# Altium project CarrierMotherboard.PrjPcb (part 2 of 3)

## Sheet Battery.SchDoc
size A3; SheetNumber: 5; SheetTotal: 9
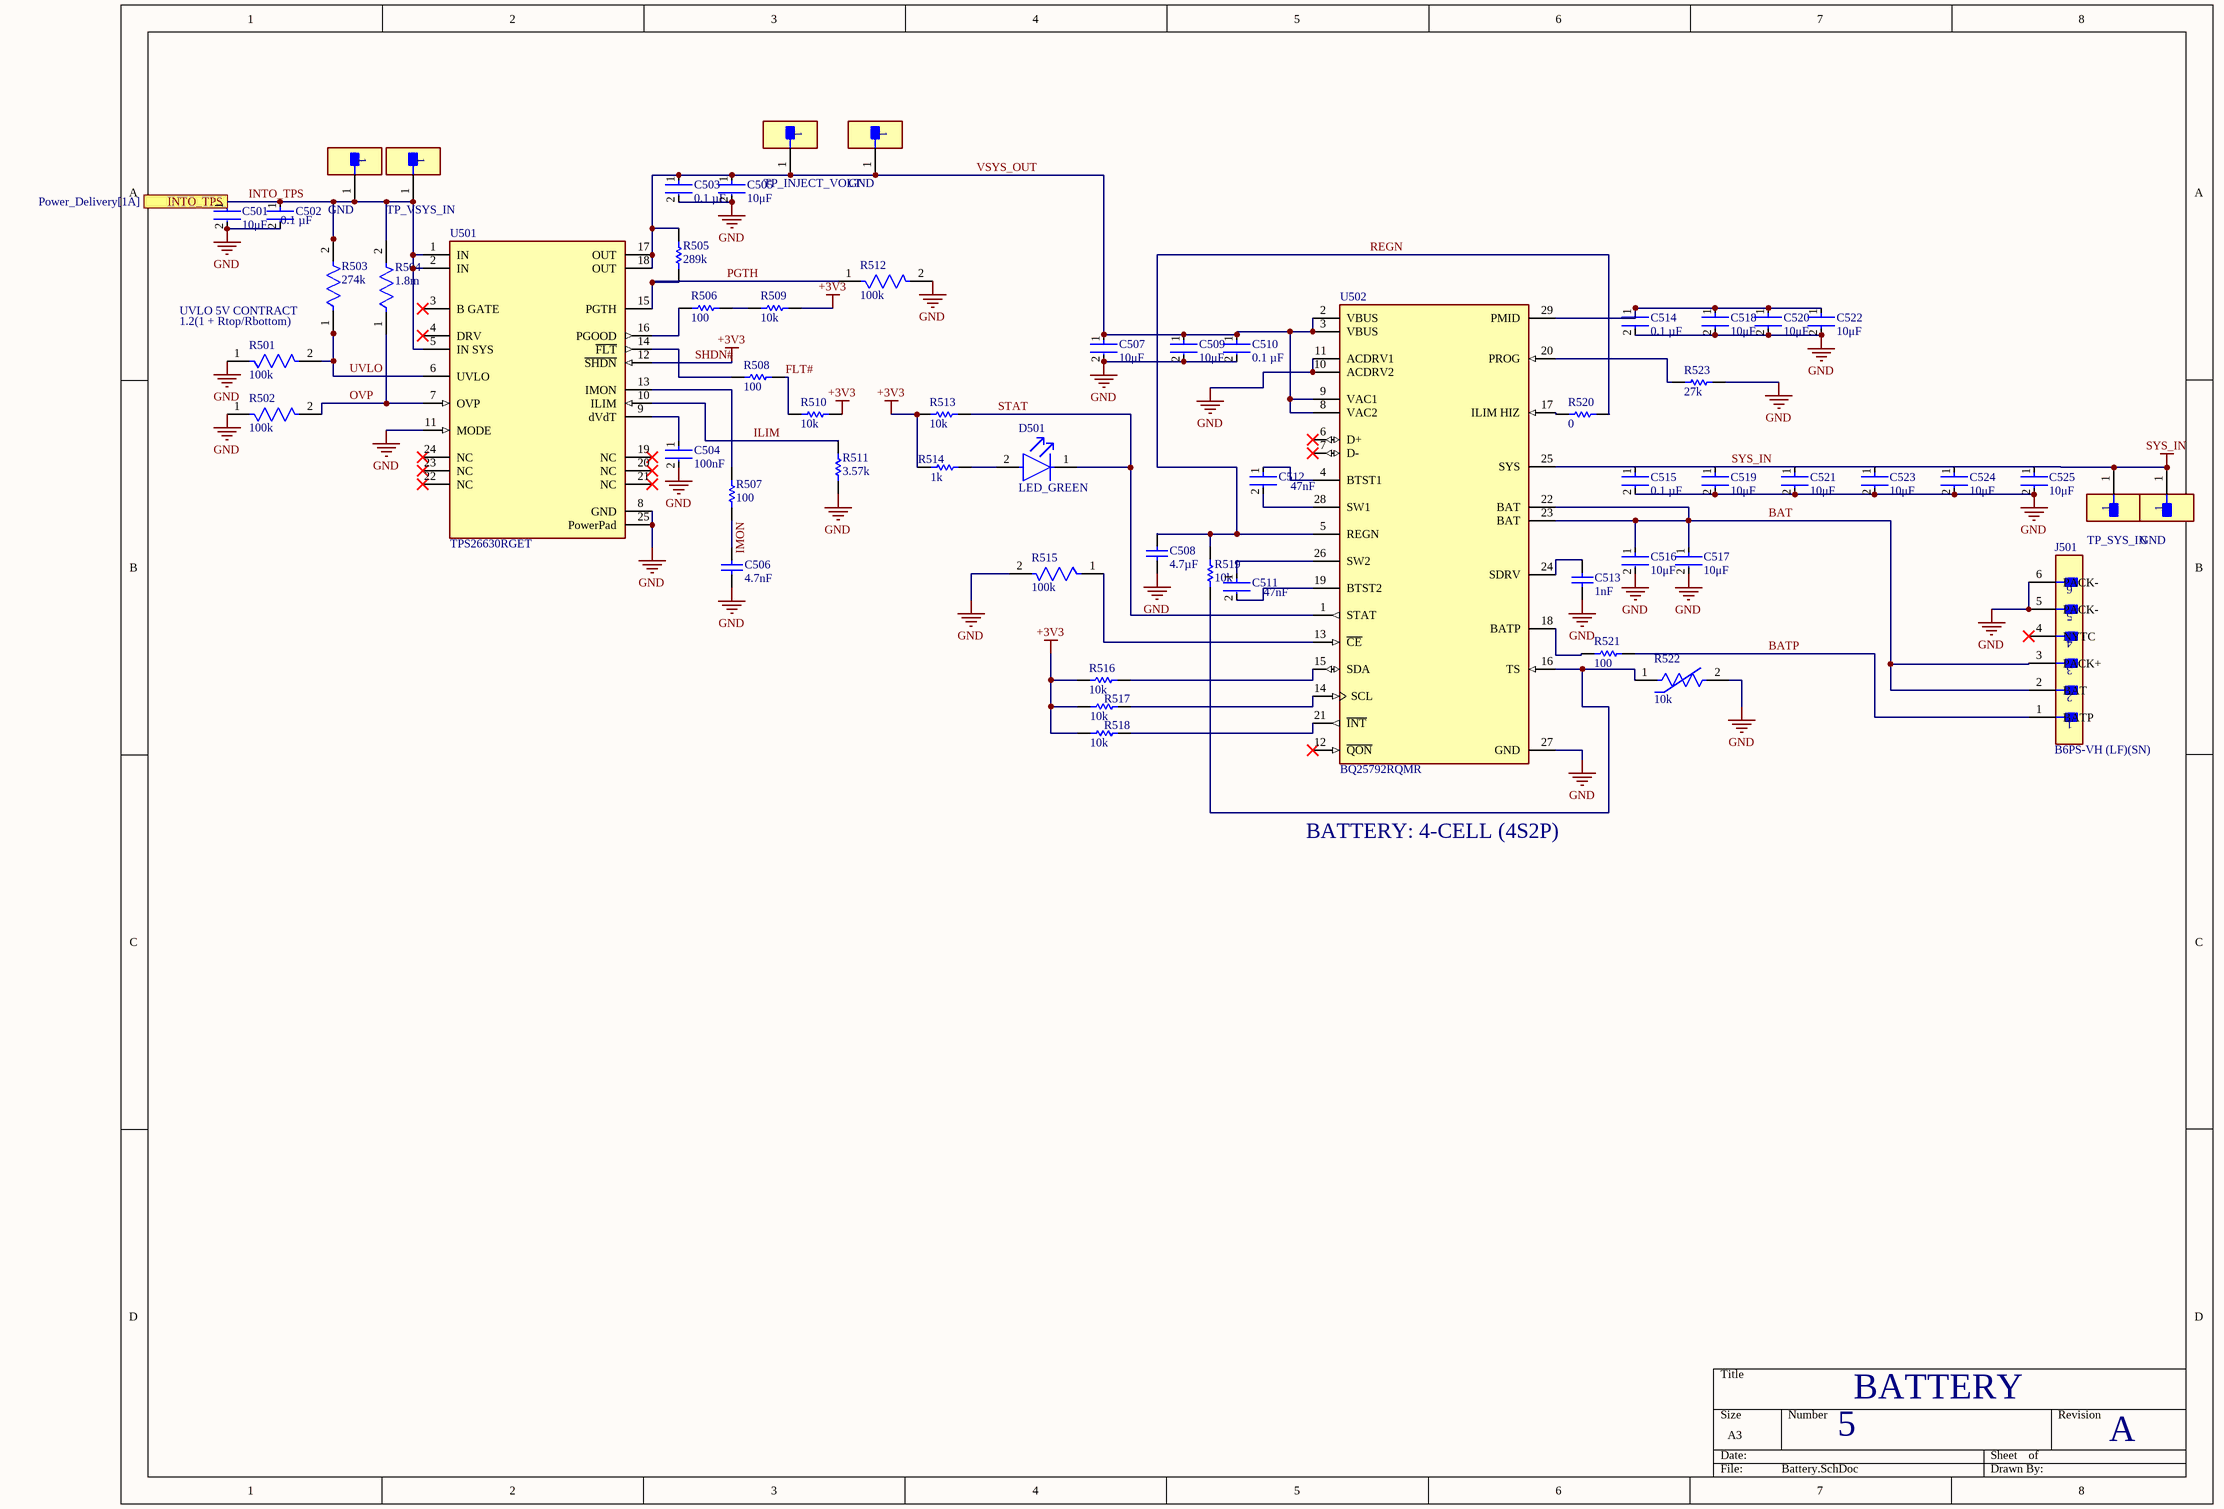
[diagram p5: Battery.SchDoc]

### Parts
C501  10μF  [FP-GRM31C-0_2-e0_3_0_8-MFG]
C502  0.1 µF  [FP-GRM155-0_05-IPC_B]
C503  0.1 µF  [FP-GRM155-0_05-IPC_B]
C504  100nF  [FP-GRM155-0_05-IPC_C]
C505  10μF  [FP-GRM31C-0_2-e0_3_0_8-MFG]
C506  4.7nF  [CAPC1005X55X25LL05T10]
C507  10μF  [FP-GRM31C-0_2-e0_3_0_8-MFG]
C508  4.7µF  [CAPC1608X90X35NL10T15]
C509  10μF  [FP-GRM31C-0_2-e0_3_0_8-MFG]
C510  0.1 µF  [FP-GRM155-0_05-IPC_B]
C511  47nF  [FP-GRM155-0_05-MFG]
C512  47nF  [FP-GRM155-0_05-MFG]
C513  1nF  [CAPC1005X55X25ML5T10]
C514  0.1 µF  [FP-GRM155-0_05-IPC_B]
C515  0.1 µF  [FP-GRM155-0_05-IPC_B]
C516  10μF  [FP-GRM31C-0_2-e0_3_0_8-MFG]
C517  10μF  [FP-GRM31C-0_2-e0_3_0_8-MFG]
C518  10μF  [FP-GRM31C-0_2-e0_3_0_8-MFG]
C519  10μF  [FP-GRM31C-0_2-e0_3_0_8-MFG]
C520  10μF  [FP-GRM31C-0_2-e0_3_0_8-MFG]
C521  10μF  [FP-GRM31C-0_2-e0_3_0_8-MFG]
C522  10μF  [FP-GRM31C-0_2-e0_3_0_8-MFG]
C523  10μF  [FP-GRM31C-0_2-e0_3_0_8-MFG]
C524  10μF  [FP-GRM31C-0_2-e0_3_0_8-MFG]
C525  10μF  [FP-GRM31C-0_2-e0_3_0_8-MFG]
D501  LED_GREEN  [FP-SML-D12-MFG]
J501  B6PS-VH (LF)(SN)  [FP-B6PS-VH_LF_SN-MFG]
R501  100k  [FP-RC0402-0_4-IPC_A]
R502  100k  [FP-RC0402-0_4-IPC_A]
R503  274k  [FP-AC0603-IPC_C]
R504  1.8m  [FP-CRCW0402-e3-MFG]
R505  289k  [RESC1005X40X25LL05T10]
R506  100  [RESC1005X40X25ML05T10]
R507  100  [RESC1005X40X25ML05T10]
R508  100  [RESC1005X40X25ML05T10]
R509  10k  [RESC1005X40X25LL05T10]
R510  10k  [RESC1005X40X25LL05T10]
R511  3.57k  [RESC1005X40X25ML05T10]
R512  100k  [FP-RC0402-0_4-IPC_A]
R513  10k  [RESC1005X40X25LL05T10]
R514  1k  [RESC3216X60X45ML15T20]
R515  100k  [FP-RC0402-0_4-IPC_A]
R516  10k  [RESC1005X40X25LL05T10]
R517  10k  [RESC1005X40X25LL05T10]
R518  10k  [RESC1005X40X25LL05T10]
R519  10k  [RESC1005X40X25LL05T10]
R520  0  [RESC1005X40X25NL05T10]
R521  100  [RESC1005X40X25ML05T10]
R522  10k  [FP-NCP15-NCU15-0_05-IPC_C]
R523  27k  [RESC1005X40X25LL05T10]
TP500  GND  [FP-S2751-46R-MFG]
TP501  TP_VSYS_IN  [FP-S2751-46R-MFG]
TP502  TP_INJECT_VOLT  [FP-S2751-46R-MFG]
TP503  GND  [FP-S2751-46R-MFG]
TP504  TP_SYS_IN  [FP-S2751-46R-MFG]
TP505  GND  [FP-S2751-46R-MFG]
U501  TPS26630RGET  [FP-RGE0024H-MFG]
U502  BQ25792RQMR  [FP-RQM0029A-MFG]

### Ports
INTO_TPS (see Power_Delivery[1A])

### Nets
+3V3: R509.2 R510.2 R513.1 R514.2 R516.1 R517.1 R518.1 U501.12(~{SHDN})  [also labelled SHDN#]  [project net 3V3_M2]
GND: C501.2 C502.2 C503.2 C504.2 C505.2 C506.1 C507.2 C508.1 C509.2 C510.2 C513.1 C514.2 C515.2 C516.2 C517.2 C518.2 C519.2 C520.2 C521.2 C522.2 C523.2 C524.2 C525.2 J501.5(PACK-) J501.6(PACK-) R501.1 R502.1 R511.1 R512.2 R515.2 R522.2 R523.2 U501.8(GND) U501.11(MODE) U501.25(PowerPad) U502.10(ACDRV2) U502.11(ACDRV1) U502.27(GND)  [project net 3V3_VDRV]
SYS_IN: TP504.1 TP505.1 U502.25(SYS)
BAT: C516.1 C517.1 J501.2(BAT) J501.3(PACK+) U502.22(BAT) U502.23(BAT)
BATP: J501.1(BATP) R521.2
FLT#: R508.2 R510.1
ILIM: R511.2 U501.10(ILIM)
IMON: C506.2 R507.1
INTO_TPS: C501.1 C502.1 R503.2 R504.2 TP500.1 TP501.1 U501.1(IN) U501.2(IN) U501.5(IN_SYS) ; port INTO_TPS
OVP: R502.2 R504.1 U501.7(OVP)
PGTH: R505.1 R512.1 U501.15(PGTH)
REGN: C508.2 R519.1 R520.2 U502.5(REGN)
STAT: D501.1(C) R513.2 U502.1(STAT)
UVLO: R501.2 R503.1 U501.6(UVLO)
VSYS_OUT: C503.1 C505.1 C507.1 C509.1 C510.1 R505.2 TP502.1 TP503.1 U501.17(OUT) U501.18(OUT) U502.2(VBUS) U502.3(VBUS) U502.8(VAC2) U502.9(VAC1)
NetC504_1: C504.1 U501.9(dVdT)
NetC511_1: C511.1 U502.26(SW2)
NetC511_2: C511.2 U502.19(BTST2)
NetC512_1: C512.1 U502.4(BTST1)
NetC512_2: C512.2 U502.28(SW1)
NetC513_2: C513.2 U502.24(SDRV)
NetC514_1: C514.1 C518.1 C520.1 C522.1 U502.29(PMID)
NetD501_2: D501.2(A) R514.1
NetR506_1: R506.1 U501.16(PGOOD)
NetR506_2: R506.2 R509.1
NetR507_2: R507.2 U501.13(IMON)
NetR508_1: R508.1 U501.14(~{FLT})
NetR515_1: R515.1 U502.13(~{CE})
NetR516_2: R516.2 U502.15(SDA)
NetR517_2: R517.2 U502.14(SCL)
NetR518_2: R518.2 U502.21(~{INT})
NetR519_2: R519.2 R522.1 U502.16(TS)
NetR520_1: R520.1 U502.17(ILIM_HIZ)
NetR521_1: R521.1 U502.18(BATP)
NetR523_1: R523.1 U502.20(PROG)

Not connected (* = marked no-connect by the designer): C515 1; C519 1; C521 1; C523 1; C524 1; C525 1; J501 4(NYTC)*; U501 3(B_GATE)* 4(DRV)* 19(NC)* 20(NC)* 21(NC)* 22(NC)* 23(NC)* 24(NC)*; U502 6(D+)* 7(D-)* 12(~{QON})*

### Notes on the sheet
- UVLO 5V CONTRACT
- 1.2(1 + Rtop/Rbottom)
- BATTERY: 4-CELL (4S2P)
- 5
- BATTERY
- A

### Library data of the parts
C501 C505 C507 C509 C516-C525 = CMP-06035-005515-1: Chip Multilayer Ceramic Capacitors for General Purpose, 1206, 10uF, X7R, 15%, 10%, 25V; Dielectric: X7R; Max Operating Temperature: 125°C; Capacitance: 10uF; Voltage Rating (DC): 25V; Case/Package: 1206; Thickness: 0.071inch; Tolerance: 10%; Voltage Rating: 25V; Mount: Surface Mount; Width: 0.063inch; Length: 0.126inch; Min Operating Temperature: -55°C; Packaging: Tape and Reel; Lead Free: Lead Free; Voltage: 25V
C502 C503 C510 C514 C515 = CMP-06035-003750-1: Chip Multilayer Ceramic Capacitors for General Purpose, 0402, 0.10uF, X7R, 15%, 10%, 50V; Capacitance: 100nF; Weight: 0.000212oz; Package Quantity: 50000; Resistor Type: Ceramic; Mount: Surface Mount; Width: 0.5mm; Case Code (Imperial): 0402; Termination: SMD/SMT; Case/Package: 0402; Voltage Rating: 50V; Height: 0.5mm; Length: 0.039inch; Dielectric: X7R; Case Code (Metric): 1005; Min Operating Temperature: -55°C; Thickness: 0.022inch; Tolerance: 10%; Lead Free: Lead Free; Packaging: Tape and Reel; Max Operating Temperature: 125°C; Voltage Rating (DC): 50V
C504 = CMP-06035-003995-1: Chip Multilayer Ceramic Capacitors for General Purpose, 0402, 0.10uF, X7R, 15%, 10%, 25V; Resistor Type: Ceramic; Capacitance: 100nF; Tolerance: 10%; Case Code (Metric): 1005; Termination: SMD/SMT; Mount: Surface Mount; Voltage Rating: 25V; Voltage Rating (DC): 25V; Case Code (Imperial): 0402; Max Operating Temperature: 125°C; Weight: 0.000212oz; Case/Package: 0402; Length: 0.039inch; Width: 0.5mm; Thickness: 0.022inch; Height: 0.5mm; Packaging: Tape and Reel; Package Quantity: 50000; Min Operating Temperature: -55°C; Dielectric: X7R
C506 = CMP-2008-04609-1: Manufacturer: Murata; Part Number: GRM155R71C472KA01D
C508 = CMP-2006-02810-1: Manufacturer: Murata; Part Number: GRM188R61A475KE15D
C511 C512 = CMP-06035-009452-1: Chip Multilayer Ceramic Capacitors for General Purpose, 0402, 47000pF, X7R, 15%, 10%, 50V; Tolerance: 10%; Capacitance: 47nF; Max Operating Temperature: 125°C; Termination: SMD/SMT; Width: 0.02inch; Package Quantity: 10000; Resistor Type: Ceramic; Packaging: Tape and Reel; Height: 0.5mm; Voltage Rating (DC): 50V; Length: 0.039inch; Dielectric: X7R; Case Code (Imperial): 0402; Voltage Rating: 50V; Mount: Surface Mount; Min Operating Temperature: -55°C; Case Code (Metric): 1005; Weight: 0.000212oz; Case/Package: 0402; Thickness: 0.022inch
C513 = CMP-1662-00017-1: Chip Capacitor, 1 nF, +/- 10%, 50 V, -55 to 125 degC, 0402 (1005 Metric), RoHS, Tape and Reel; Case\/Package: 0402; Type (Capacitors): X7R; Voltage Rating (DC): 50 V; Width: 0.5 mm; Pins: 2; REACH SVHC: No SVHC; Length: 1 mm; Height: 0.5 mm; PackageDescription: 2-Pin Surface Mount Device, Body 1 x 0.5 mm; DatasheetVersion: 07/2016; Mount: Surface Mount; ComponentLink2Description: Datasheet; Tolerance: 10%; ComponentLink2URL: http://psearch.en.murata.com/capacitor/product/GRM155R71H102KA01%23.pdf; ComponentLink1URL: http://www.murata.com/; Case Code (Metric): 1005; Package Quantity: 10000; Min Operating Temperature: -55 degC; Max Operating Temperature: 125 degC; Capacitance: 1 nF; Voltage Rating: 50 V; ComponentLink1Description: Manufacturer URL; Packaging: Tape and Reel; Radiation Hardening: No; RoHSCompliant: true; PackageReference: 0402; Mounting Technology: Surface Mount; Case Code (Imperial): 0402
D501 = CMP-08952-000005-1: LED YLW/GREEN DIFFUSED 1608 SMD; Manufacturer Part Number: SML-D12M1WT86; Manufacturer: Rohm; Led Orientation: Top View; Forward Voltage: 2.2V; Power Dissipation: 54mW; Wavelength: 572nm; Colour: Green; Reverse Voltage: 5V; Forward Current: 20mA; Luminous Intensity: 30mcd; RoHS: TRUE; Package: SML-D12; Temperature Range Low: -40°C; Device Class L3: unset; Temperature Range High: +85°C; Device Class L2: LEDs; Category: Diode; Device Class L1: Optoelectronics; Digikey Description: LED YLW/GREEN DIFFUSED 1608 SMD; Temperature: -40°C to +85°C; ComponentLink2Description: Datasheet; Automotive: No; Height: 0.65mm; Lead Free: Yes; Octopart: https://octopart.com/sml-d12m1wt86-rohm-70837112; ComponentLink2URL: https://www.rohm.com/datasheet/SML-D12M1W
J501 = CMP-17439-000282-2: CONN HEADER R/A 6POS 3.96MM; Gender: Male; Contact Resistance: 20mR; Max Current Rating: 10A; Voltage Rating: 250V; Number of Contacts: 6; Packaging: Bulk; Current Rating: 10A; Contact Mating Length: 0.303inch; Fastening Type: Ramp; Contact Material: Brass; Number of Rows: 1; Termination: Solder; Number of Positions: 6; Depth: 14.9mm; Orientation: Right Angle; Contact Finish - Mating: TIN; Contact Plating: Copper; Mount: Through Hole; Insulation Material: Nylon; Contact Type: Male Pin; Insulation Color: Natural; Max Voltage Rating (AC): 250V; Housing Color: White; Length: 23.7mm; Min Operating Temperature: -25°C; Series: VH; Connector Type: Header; Pitch: 3.96mm; Flammability Rating: UL94 V-0; Max Operating Temperature: 85°C; Color: Natural; Lead Free: Lead Free; Housing Material: Polyamide; Contact Shape: Square
R501 R502 R512 R515 = CMP-2002-07913-2: RES 100K OHM 5% 1/16W 0402; Temperature Coefficient: 100ppm/°C; Max Power Dissipation: 63mW; Resistance: 100kR; Voltage Rating: 50V; Tolerance: 5%; Packaging: Tape and Reel; Termination: SMD/SMT; Case Code (Metric): 1005; Length: 1mm; Power Rating: 63mW; Min Operating Temperature: -55°C; Case/Package: 0402; Construction: Rectangular; Series: RC; Resistance Tolerance: 5%; Height: 0.016inch; Case Code (Imperial): 0402; RoHS Compliant: Yes; Size Code: 0402; Number of Terminations: 2; Features: Moisture Resistant; Width: 0.02inch; Max Operating Temperature: 155°C; Military Standard: Not; Lead Free: Lead Free; Depth: 0.5mm; Package Quantity: 1; Resistor Type: Thick Film
R503 = CMP-03412-027770-2: RES 274KΩ 1.00% 0.1W 0603; Resistance: 274kR; Max Power Dissipation: 100mW; Tolerance: 1%; Temperature Coefficient: 100ppm/°C; Voltage Rating: 50V; Features: Moisture Resistant; Min Operating Temperature: -55°C; Width: 0.8mm; RoHS Compliant: Yes; Resistor Type: Thick Film; Termination: SMD/SMT; Number of Terminations: 2; Power Rating: 100mW; Case Code (Metric): 1608; Max Operating Temperature: 155°C; Series: AC; Length: 0.063inch; Case/Package: 0603; Weight: 7.1E-05oz; Case Code (Imperial): 0603; Height: 0.022inch; Packaging: Tape and Reel
R504 = CMP-2002-08335-4: RES Thick Film, 1.78MΩ, 1%, 0.063W, 100ppm/°C, 0402; Max Power Dissipation: 63mW; Resistance: 1.78MR; Voltage Rating: 50V; Package Quantity: 10000; Depth: 0.5mm; Length: 1mm; Weight: 2.3E-05oz; Width: 0.5mm; Case Code (Imperial): 0402; Radiation Hardening: No; Number of Terminations: 2; Temperature Coefficient: 100ppm/°C; Lead Free: Lead Free; Contact Plating: Tin; Voltage Rating (DC): 50V; Height: 0.016inch; Features: Automotive AEC-Q200; Case Code (Metric): 1005; Max Operating Temperature: 155°C; Case/Package: 0402; Number of Pins: 2; Power Rating: 63mW; Tolerance: 1%; Packaging: Tape and Reel; Military Standard: Not; Composition: Thick Film; Min Operating Temperature: -55°C
R505 = CMP-1011-00786-2: Part Number: RC0402FR-07287KL; Manufacturer: Yageo
R506-R508 R521 = CMP-2002-07344-1: Part Number: RC0402FR-07100RL; Manufacturer: Yageo / Phycomp
R509 R510 R513 R516-R519 = CMP-2002-07353-1: Part Number: RC0402FR-0710KL; Manufacturer: Yageo / Phycomp
R511 = CMP-2002-07655-1: Part Number: RC0402FR-073K57L; Manufacturer: Yageo
R514 = CMP-2100-03616-1: Chip Resistor, 1 KOhm, +/- 1%, 0.25 W, -55 to 155 degC, 1206 (3216 Metric), RoHS, Tape and Reel; Manufacturer: Vishay Semiconductor; Power Rating: 250mW; Voltage Rating (DC): 200V; Resistance: 1KOhm; Temperature Coefficient: 100ppm/degreesC; Case Code (Imperial): 1206; Length: 3.2mm; Case/Package: 1206; Contact Plating: Tin; Package Quantity: 10; Datasheet URL: http://www.farnell.com/datasheets/1720486.pdf; Mount: SurfaceMount; Package Description: 2-Pin Surface Mount Device, Body 3.15 x 1.6 mm; Package Reference: 1206.0; Max Operating Temperature: 155degC; Lead Free: LeadFree; Weight: 0.000353oz; Military Standard: Not; Max Power Dissipation: 250mW; Case Code (Metric): 3216; Number of Terminations: 2; Tolerance: 1%; Width: 0.063inch; Termination: SMD/SMT; Number of Pins: 2; Min Operating Temperature: -55degC; Height: 0.55mm; Depth: 1.6mm; RoHSCompliant: true; Composition: ThickFilm; Packaging: TapeandReel; Manufacturer URL: http://www.vishay.com/; Voltage Rating: 200V; Radiation Hardening: No; REACH SVHC: Unknown; Datasheet Version: 41061.0
R520 = CMP-1011-00001-2: Manufacturer: Yageo / Phycomp; Part Number: RC0402JR-070RL
R522 = CMP-06022-000003-3: NTC Thermistor for Temperature Sensor, 0402, 10kΩ, 1%, 0.1mA, 5V; Max Power Dissipation: 100mW; Resistance: 10kR; Current Rating: 310uA; Length: 1mm; Min Operating Temperature: -40°C; Max Operating Temperature: 125°C; Resistance Tolerance: 1%; Lead Free: Lead Free; Radiation Hardening: No; Case Code (Imperial): 0402; Depth: 0.5mm; Tolerance: 1%; Packaging: Tape and Reel; Package Quantity: 10000; Series: NCP; Number of Pins: 2; Power Rating: 100mW; Case/Package: 0402; Case Code (Metric): 1005; Height: 0.5mm; Termination: SMD/SMT; RoHS Compliant: Yes; REACH SVHC: No SVHC; Mount: Surface Mount
R523 = CMP-2002-07025-1: Manufacturer: Yageo / Phycomp; Part Number: RC0402FR-0727KL
TP500-TP505 = CMP-15817-000010-1: PC TEST POINT NATURAL; Plating: Tin; Body Material: Brass; Color: Natural; Material: Copper Alloy; Mount: Surface Mount; Packaging: Cut Tape
U501 = CMP-04910-000050-1: POWER MANAGEMENT; RoHS Compliant: Yes
U502 = CMP-04911-000031-1: I2C CONTROLLED, 5-A, 1-4 CELL BU; RoHS Compliant: Yes

## Sheet DCDC.SchDoc
size A3; SheetNumber: 6; SheetTotal: 9
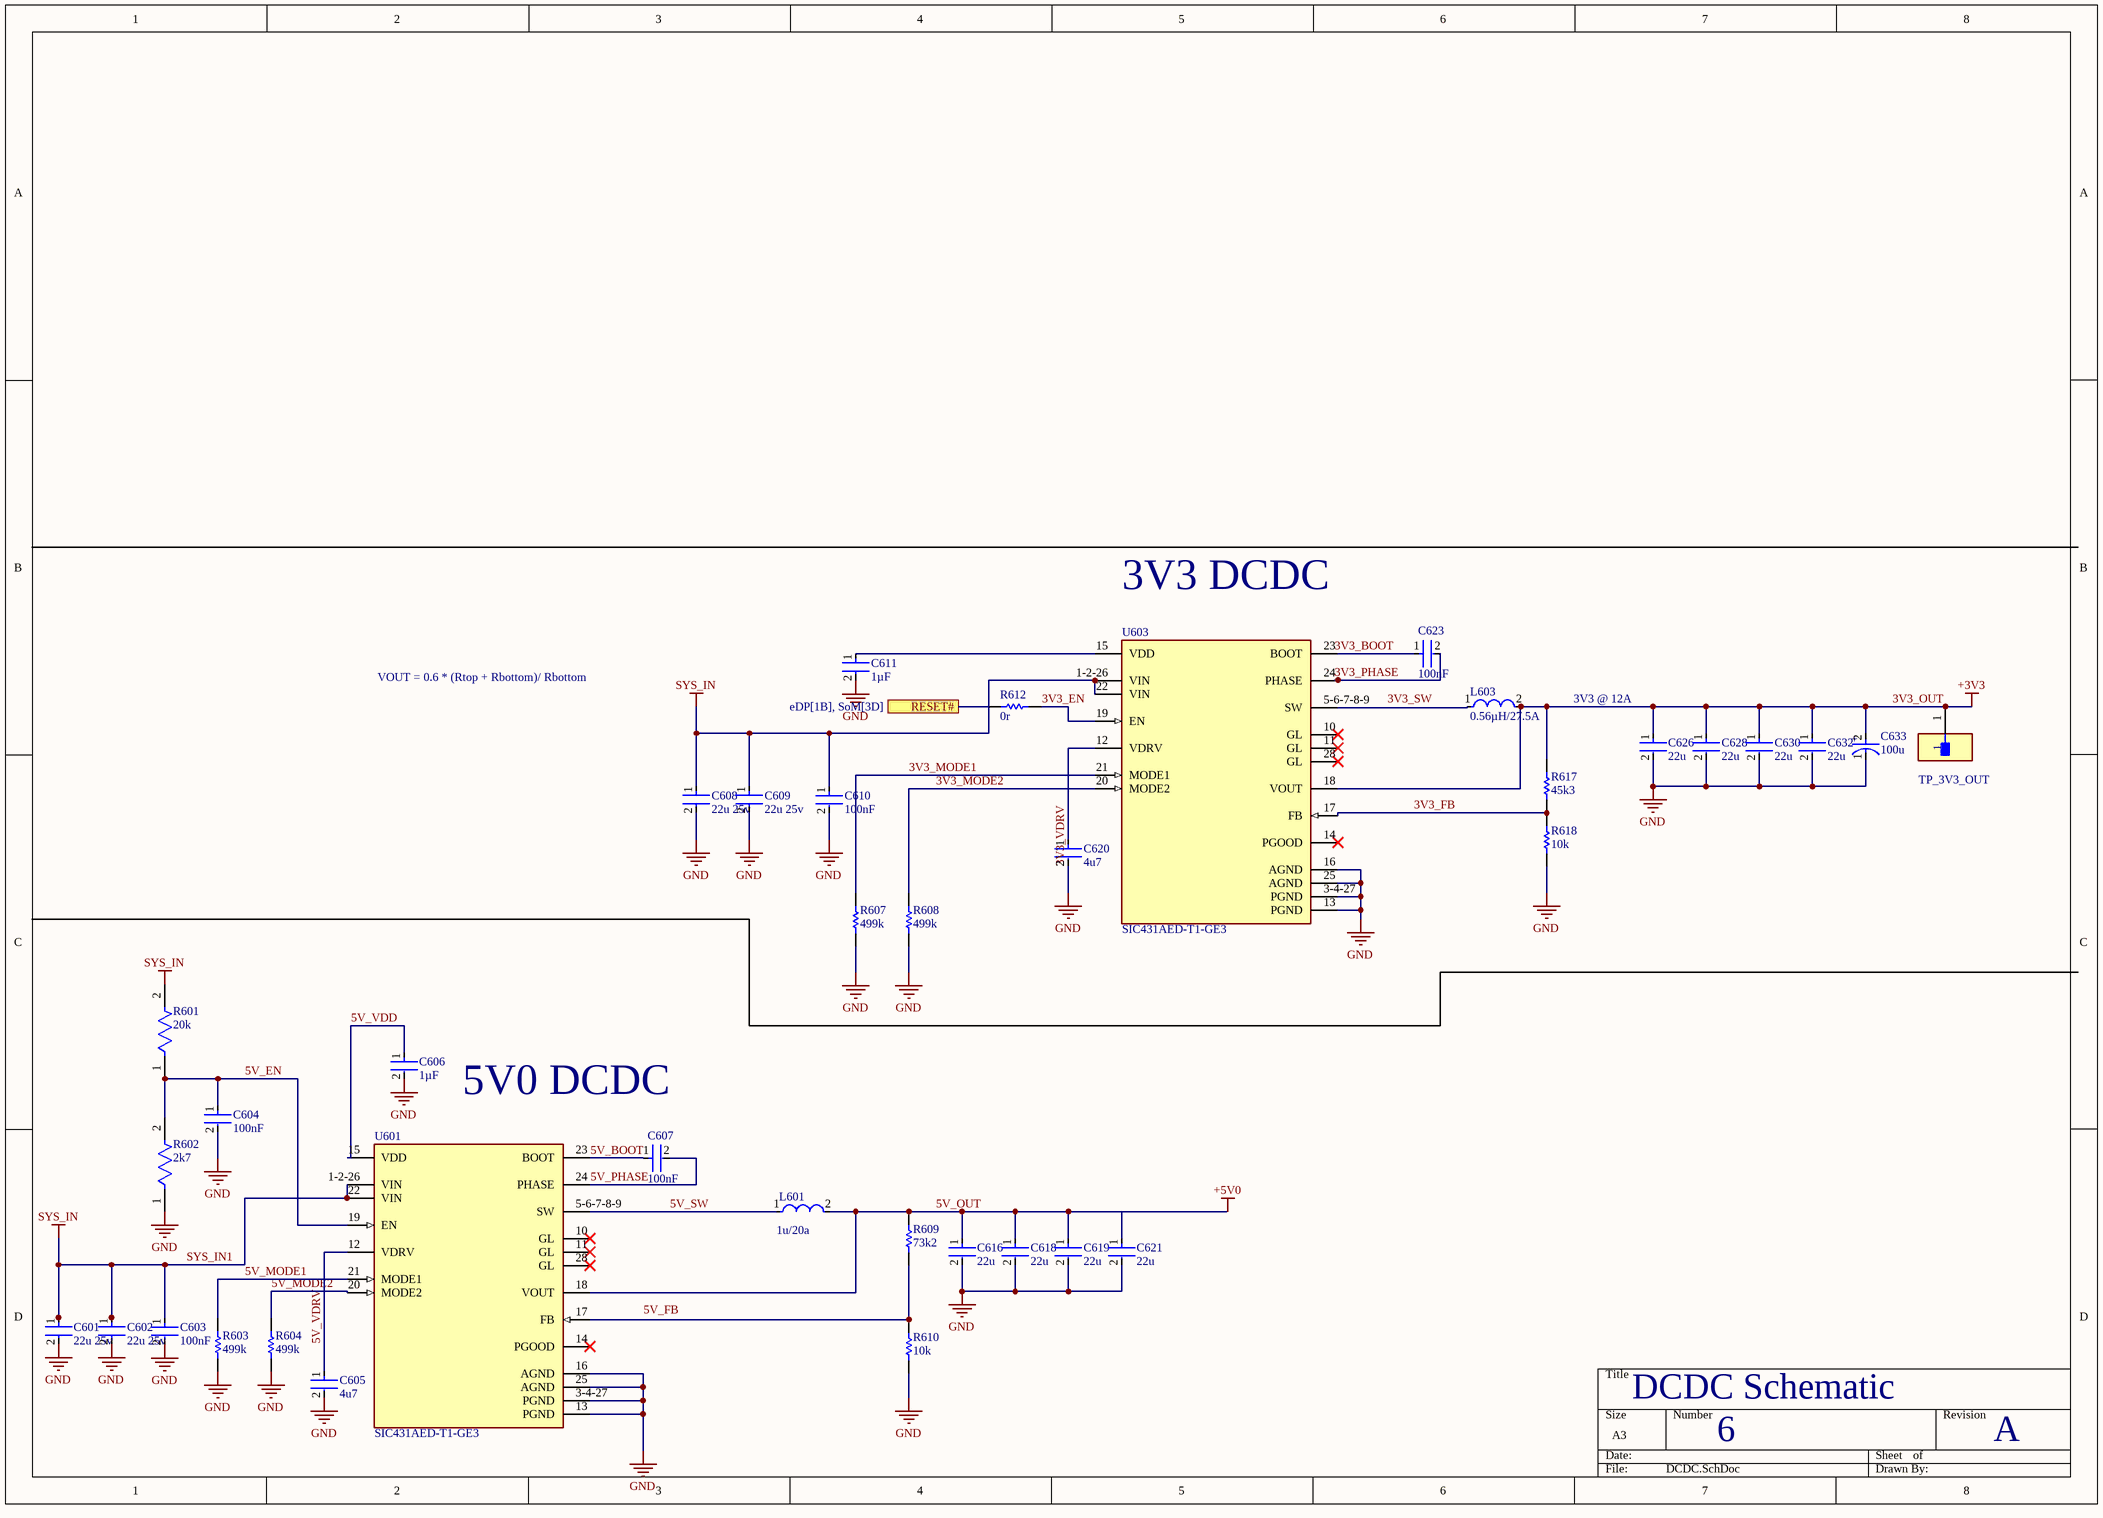
[diagram p6: DCDC.SchDoc]

### Parts
C601  22u 25v  [FP-GRM21B-0_2-e0_2_0_7-IPC_B]
C602  22u 25v  [FP-GRM21B-0_2-e0_2_0_7-IPC_B]
C603  100nF  [FP-GRM155-0_05-IPC_B]
C604  100nF  [FP-GRM155-0_05-IPC_B]
C605  4u7  [FP-GRM155-0_2-MFG]
C606  1µF  [FP-GRM15-0_1-MFG]
C607  100nF  [FP-GRM155-0_05-IPC_B]
C608  22u 25v  [FP-GRM21B-0_2-e0_2_0_7-IPC_B]
C609  22u 25v  [FP-GRM21B-0_2-e0_2_0_7-IPC_B]
C610  100nF  [FP-GRM155-0_05-IPC_B]
C611  1µF  [FP-GRM15-0_1-MFG]
C616  22u  [FP-CL10-IPC_B]
C618  22u  [FP-CL10-IPC_B]
C619  22u  [FP-CL10-IPC_B]
C620  4u7  [FP-GRM155-0_2-MFG]
C621  22u  [FP-CL10-IPC_B]
C623  100nF  [FP-GRM155-0_05-IPC_B]
C626  22u  [FP-CL10-IPC_B]
C628  22u  [FP-CL10-IPC_B]
C630  22u  [FP-CL10-IPC_B]
C632  22u  [FP-CL10-IPC_B]
C633  100u  [FP-OS-CON-SMT-B6-MFG]
L601  1u/20a  [FP-SRP6050CA-MFG]
L603  0.56µH/27.5A  [FP-IHLP-4040DZ-FP_3_175x4-MFG]
R601  20k  [FP-CR0402-IPC_A]
R602  2k7  [FP-CR0402-IPC_B]
R603  499k  [RESC1005X40X25NL10T10]
R604  499k  [RESC1005X40X25NL10T10]
R607  499k  [RESC1005X40X25NL10T10]
R608  499k  [RESC1005X40X25NL10T10]
R609  73k2  [RESC1005X40X25LL10T10]
R610  10k  [RESC1005X40X25LL05T10]
R612  0r  [RESC1005X40X25LL05T05]
R617  45k3  [RESC1005X40X25ML05T10]
R618  10k  [RESC1005X40X25LL05T10]
TP603  TP_3V3_OUT  [FP-S2751-46R-MFG]
U601  SIC431AED-T1-GE3  [FP-T22-0442-MFG]
U603  SIC431AED-T1-GE3  [FP-T22-0442-MFG]

### Ports
RESET# (see eDP[1B], SoM[3D])

### Nets
3V3_VDRV: C601.2 C602.2 C603.2 C604.2 C605.2 C606.2 C608.2 C609.2 C610.2 C611.2 C616.2 C618.2 C619.2 C620.2 C621.2 C626.2 C628.2 C630.2 C632.2 C633.1(C) R602.1 R603.1 R604.1 R607.1 R608.1 R610.1 R618.1 U601.3-4-27(PGND) U601.13(PGND) U601.16(AGND) U601.25(AGND) U603.3-4-27(PGND) U603.13(PGND) U603.16(AGND) U603.25(AGND)  [also labelled GND]
+3V3: C626.1 C628.1 C630.1 C632.1 C633.2(A) L603.2 R617.2 TP603.1 U603.18(VOUT)  [also labelled 3V3_OUT]  [project net 3V3_M2]
SYS_IN: C601.1 C602.1 C603.1 C608.1 C609.1 C610.1 R601.2 U601.1-2-26(VIN) U601.22(VIN) U603.1-2-26(VIN) U603.22(VIN)  [also labelled SYS_IN1]
3V3_EN: R612.2 U603.19(EN)
3V3_FB: R617.1 R618.2 U603.17(FB)
3V3_MODE1: R607.2 U603.21(MODE1)
3V3_MODE2: R608.2 U603.20(MODE2)
3V3_PHASE: C623.2 U603.24(PHASE)
5V_EN: C604.1 R601.1 R602.2 U601.19(EN)
5V_MODE1: R603.2 U601.21(MODE1)
5V_MODE2: R604.2 U601.20(MODE2)
5V_OUT: C616.1 C618.1 C619.1 C621.1 L601.2 R609.2 U601.18(VOUT)
5V_PHASE: C607.2 U601.24(PHASE)
5V_SW: L601.1 U601.5-6-7-8-9(SW)
5V_VDD: C606.1 U601.15(VDD)
5V_VDRV: C605.1 U601.12(VDRV)
SYS_RESET#: R612.1 ; port RESET#
NetC607_1: C607.1 U601.23(BOOT)
NetC611_1: C611.1 U603.15(VDD)
NetC620_1: C620.1 U603.12(VDRV)
NetC623_1: C623.1 U603.23(BOOT)
NetL603_1: L603.1 U603.5-6-7-8-9(SW)
NetR609_1: R609.1 R610.2 U601.17(FB)

Not connected (* = marked no-connect by the designer): U601 10(GL)* 11(GL)* 14(PGOOD)* 28(GL)*; U603 10(GL)* 11(GL)* 14(PGOOD)* 28(GL)*

### Notes on the sheet
- (near U603) 3V3 DCDC
- VOUT = 0.6 * (Rtop + Rbottom)/ Rbottom
- 3V3 @ 12A
- 5V0 DCDC
- DCDC Schematic
- 6
- A
- Labels drawn without touching a wire or pin: 3V3_BOOT, 3V3_SW, 5V_BOOT, 5V_FB, +5V0
- (in symbol CMP-05428-000099-1) +

### Library data of the parts
C601 C602 C608 C609 = CMP-2007-03222-3: Chip Multilayer Ceramic Capacitors for General Purpose, 0805, 22uF, X5R, 15%, 20%, 25V; Case/Package: 0805; Depth: 1.25mm; Resistor Type: Ceramic; Voltage Rating: 25V; Lead Free: Lead Free; Voltage Rating (DC): 25V; Case Code (Metric): 2012; Thickness: 0.057inch; REACH SVHC: No SVHC; Material: Ceramic; Tolerance: 20%; Length: 2mm; Capacitance: 22uF; Case Code (Imperial): 0805; Max Operating Temperature: 85°C; Termination: SMD/SMT; Weight: 0.000335oz; Dielectric: X5R; Packaging: Tape and Reel; Voltage: 25V; Package Quantity: 3000; Height: 1.25mm; Mount: Surface Mount; Width: 1.25mm; Min Operating Temperature: -55°C
C603 C604 C607 C610 C623 = CMP-2008-04639-2: Chip Multilayer Ceramic Capacitors for General Purpose, 0402, 0.10uF, X7R, 15%, 10%, 50V; Dissipation Factor: 0.025%; Weight: 0.000212oz; Thickness: 0.022inch; Voltage Rating (DC): 50V; Dielectric Material: Ceramic; Termination: SMD/SMT; Case/Package: 0402; Case Code (Imperial): 0402; Mount: Surface Mount; REACH SVHC: No SVHC; Resistor Type: Ceramic; Dielectric: X7R; Max Operating Temperature: 125°C; Voltage: 50V; Lead Free: Lead Free; Package Quantity: 10000; Packaging: Tape and Reel; Capacitance: 100nF; Length: 1mm; Material: Ceramic; Height: 0.5mm; Depth: 0.5mm; Width: 0.5mm; Min Operating Temperature: -55°C; Tolerance: 10%; Case Code (Metric): 1005; Voltage Rating: 50V
C605 C620 = CMP-06035-063317-1: Chip Multilayer Ceramic Capacitors for General Purpose 0402 Package 0.7mm 4.7uF @ 20% 25Vdc X5S @ 22%
C606 C611 = CMP-2008-04556-2: CAP CER 1UF 10V X5R 0402; Manufacturer Part Number: GRM155R61A105KE15D; Manufacturer: Murata; Material: Ceramic; Tolerance: 10%; Temperature Coefficient: 15%; Octopart: https://octopart.com/grm155r61a105ke15d-murata-197442; Lead Free: Yes; ComponentLink2Description: Datasheet; Temperature: -55°C to +85°C; Temperature Range High: +85°C; Height: 0.55mm; Capacitance: 1uF; Ipc Land Pattern Name: CAPC10050X50; ComponentLink2URL: https://search.murata.co.jp/Ceramy/image/img/A01X/G101/ENG/GRM155R61A105KE15-01A.pdf; Temperature Range Low: -55°C; Device Class L2: Capacitors; Voltage Rating: 10V; RoHS: TRUE; Device Class L1: Passive Components; Device Class L3: Ceramic Capacitors; Temperature Characteristic: X5R; Mouser Description: 0402 1 uF 10 V ±10% Tolerance X5R Surface Mount Multilayer Ceramic Capacitor; Automotive: No; Package: GRM15-0.1; Digikey Description: CAP CER 1UF 10V X5R 0402; Value: 1uF; Category: Cap
C616 C618 C619 C621 C626 C628 C630 C632 = CMP-13271-002755-1: Cap Ceramic 22uF 16V X5R ±20% Pad SMD 0603 +85°C T/R; Mount: Surface Mount; Packaging: Tape and Reel; Case Code (Imperial): 0603; Max Operating Temperature: 85°C; Capacitance: 22uF; Case/Package: 0603; Voltage Rating: 16V; Tolerance: 20%; Case Code (Metric): 1608; Min Operating Temperature: -55°C
C633 = CMP-05428-000099-1: Conductive Polymer Aluminum Solid Capacitors (OS-CON) 100uF ±20% 6.3V; Ripple Current (AC): 1.97A; Dissipation Factor: 12%; Leakage Current: 300uA; ESR (Equivalent Series Resistance): 30mR; Life (Hours): 2000Hour; Polarity: Polar; Package Quantity: 1500; RoHS Compliant: Yes; Number of Pins: 6; Termination: SMD/SMT; Tolerance: 20%; Mount: Surface Mount; Case/Package: Radial; Ripple Current: 1.97A; Min Operating Temperature: -55°C; REACH SVHC: No SVHC; Height - Seated (Max): 0.236inch; Height: 5.9mm; Lead Free: Lead Free; Voltage: 6.3V; Capacitance: 100uF; Diameter: 5mm; Voltage Rating (DC): 6.3V; Construction: Cylindrical; Length: 5.9mm; Max Operating Temperature: 105°C; Packaging: Tape and Reel; Voltage Rating: 6.3V; Series: OS-CON™, SVPC
L601 = CMP-07248-000017-1: FIXED IND 1UH 20A 4.52 MOHM SMD; Manufacturer: Bourns; Manufacturer Part Number: SRP6050CA-1R0M; Shielding: true; Saturation Current: 23A; Core Material: Metal alloy powder; Series Resistance: 4.52mΩ; Tolerance: 20%; Self Resonant Frequency: 50MHz; Automotive Grade: Grade 0; Test Frequency: 100kHz; Octopart: https://octopart.com/srp6050ca-1r0m-bourns-92222725; Device Class L1: Passive Components; RoHS: TRUE; Device Class L2: Inductors; Temperature Range High: +155°C; Value: 1uH; Inductance: 1uH; Automotive: Yes; Height: 5mm; Package: SRP6050CA; Category: Ind; ComponentLink2Description: Datasheet; Device Class L3: Fixed Inductors; Mouser Description: Inductor Power Shielded Wirewound 1uH 20% 100KHz Metal Alloy Powder 20A 4.52mOhm DCR T/R; ComponentLink2URL: https://www.bourns.com/docs/Product-Datasheets/SRP6050CA.pdf; Lead Free: Yes; Temperature Range Low: -55°C; Rms Current: 20A; Temperature: -55°C to +155°C; Digikey Description: FIXED IND 1UH 20A 4.52 MOHM SMD; Composition: Wirewound
L603 = CMP-02424-000366-1: Commercial Inductors, High Saturation Series 0.56uH 27.5A 1.8mΩ 20%; Shielding: Shielded; Max DC Current: 49A; Inductance: 560nH; Core Material: Metal; DC Resistance (DCR): 1.8mR; Test Frequency: 100kHz; Self Resonant Frequency: 5MHz; Termination: SMD/SMT; RMS Current (Irms): 27.5A; Height: 4mm; Lead Free: Lead Free; Saturation Current: 49A; Tolerance: 20%; Contact Plating: Tin; Max Operating Temperature: 125°C; Case Code (Imperial): 4040; Radiation Hardening: No; Width: 10.3mm; Depth: 10.3mm; Length: 10.92mm; Min Operating Temperature: -55°C; Current Rating: 27.5A; Package Quantity: 500; Number of Pins: 2; Packaging: Tape and Reel; Military Standard: Not; Inductance Tolerance: 20%; Weight: 0.070548oz; Mount: Surface Mount; Case/Package: 4040
R601 = CMP-1011-00655-3: Thick Film Chip Resistors 0402 20kΩ 0.0625W 1% 100ppm/°C; Power Rating: 62.5mW; Voltage Rating: 50V; Resistance: 20kR; Tolerance: 1%; Case Code (Metric): 1005; Termination: SMD/SMT; Composition: Thick Film; Packaging: Tape and Reel; Radiation Hardening: No; Package Quantity: 10000; Mount: Surface Mount; Depth: 0.5mm; Max Operating Temperature: 125°C; Length: 1mm; Width: 0.5mm; Temperature Coefficient: 100ppm/°C; Min Operating Temperature: -55°C; Thickness: 356um; Case/Package: 0402; Military Standard: Not; Case Code (Imperial): 0402; Height: 0.35mm; Contact Plating: Tin
R602 = CMP-2002-05009-2: Thick Film Chip Resistors 0402 2.7kΩ 0.0625W 1% 100ppm/°C; Max Power Dissipation: 63mW; Resistance: 2.7kR; Power Rating: 62.5mW; Voltage Rating: 50V; Tolerance: 1%; Max Operating Temperature: 125°C; Mount: Surface Mount; Case Code (Imperial): 0402; Package Quantity: 10000; Composition: Thick Film; Depth: 0.5mm; Thickness: 356um; Case/Package: 0402; Min Operating Temperature: -55°C; Case Code (Metric): 1005; Contact Plating: Tin; Width: 0.02inch; Packaging: Tape and Reel; Height: 0.016inch; Number of Terminations: 2; Length: 1mm; Temperature Coefficient: 100ppm/°C; Termination: SMD/SMT; Radiation Hardening: No; Military Standard: Not
R603 R604 R607 R608 = CMP-1011-00815-2: Manufacturer: Bourns; Part Number: CR0402-FX-4993GLF
R609 = CMP-2002-05384-1: Manufacturer: Bourns; Part Number: CR0402-FX-7322GLF
R610 R618 = CMP-2002-07353-1: as R509 on sheet Battery
R612 = CMP-2000-07451-1: Chip Resistor, 0 Ohm, 0.1 W, -55 to 155 degC, 0402 (1005 Metric), RoHS, Tape and Reel; Manufacturer: Panasonic; Voltage Rating (DC): 50V; Temperature Coefficient: 600ppm/��C; Max Power Dissipation: 100mW; Resistance: 0mOhm; Tolerance: 5%; Number of Terminations: 2; Mount: SurfaceMount; Height: 0.35mm; Packaging: TapeandReel; Contact Plating: Tin; Manufacturer URL: http://www.panasonic.com/; Composition: ThickFilm; Max Operating Temperature: 155degC; REACH SVHC: NoSVHC; Case/Package: 0402; Package Reference: 402; Depth: 0.5mm; Package Description: 2-Pin Surface Mount Device, Body 1 x 0.5 mm; Datasheet URL: https://industrial.panasonic.com/cdbs/www-data/pdf/RDA0000/AOA0000C301.pdf; RoHSCompliant: True; Case Code (Imperial): 0402; Military Standard: Not; Min Operating Temperature: -55degC; Power Rating: 100mW; Datasheet Version: 03/2015; Length: 1mm; Case Code (Metric): 1005; Termination: SMD/SMT; Mounting Technology: SurfaceMount; Voltage Rating: 50V; Width: 0.02inch; Package Quantity: 1; Lead Free: LeadFree; Radiation Hardening: No
R617 = CMP-2002-07692-1: Part Number: RC0402FR-0745K3L; Manufacturer: Yageo / Phycomp
TP603 = CMP-15817-000010-1: as TP500 on sheet Battery; Color: Natural; Material: Copper Alloy; Mount: Surface Mount; Packaging: Cut Tape
U601 U603 = CMP-00030-87948104-1: SIC431AED-T1-GE3 IC Reg Buck Adj 24A MLP44-24; Max Supply Voltage: 24V; Number of Outputs: 1; Max Junction Temperature (Tj): 125°C; Min Supply Voltage: 3V; Output Voltage: 20V; NexarPartId: 87948104; Min Operating Temperature: -40°C; Schedule B: 8542390000, 8542390000; RoHS: Non-Compliant; Max Operating Temperature: 125°C; Height: 800µm; Ambient Temperature Range High: 105°C; Output Current: 24A

## Sheet Peripherals.SchDoc
size A3; SheetNumber: 7; SheetTotal: 9
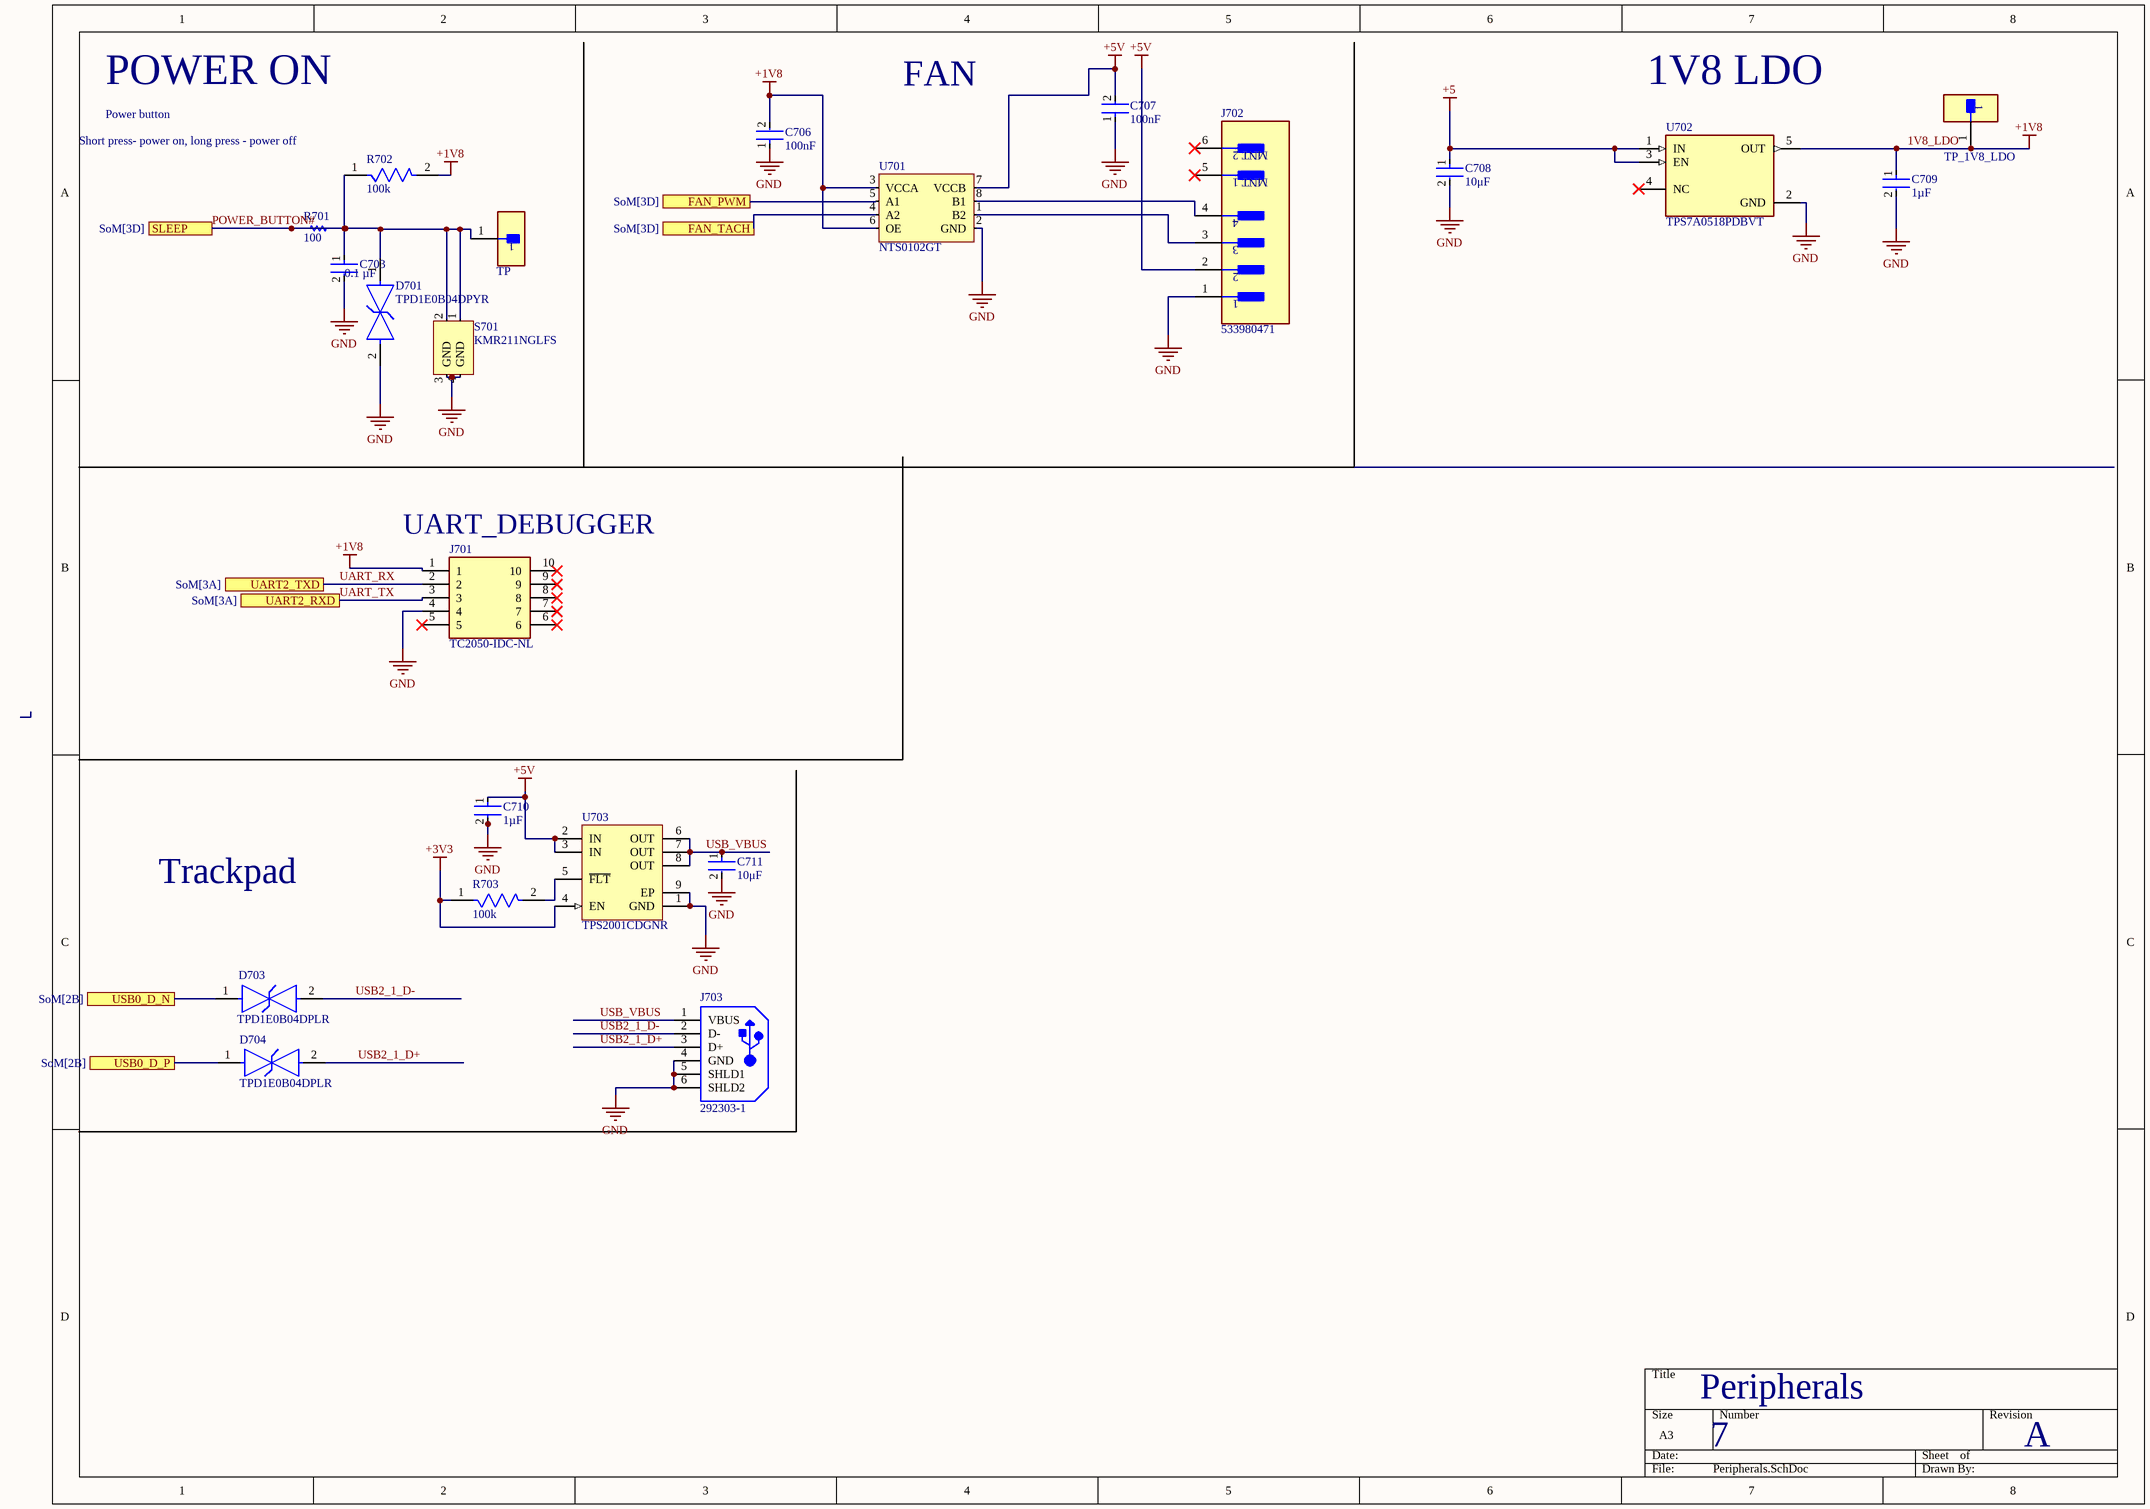
[diagram p7: Peripherals.SchDoc]

### Parts
C703  0.1 µF  [FP-GRM155-0_05-IPC_B]
C706  100nF  [FP-GRM155-0_05-IPC_B]
C707  100nF  [FP-GRM155-0_05-IPC_B]
C708  10μF  [FP-GRM31C-0_2-e0_3_0_8-MFG]
C709  1µF  [FP-GRM15-0_1-MFG]
C710  1µF  [FP-GRM15-0_1-MFG]
C711  10μF  [FP-GRM31C-0_2-e0_3_0_8-MFG]
D701  TPD1E0B04DPYR  [FP-DPY0002A-MFG]
D703  TPD1E0B04DPLR  [FP-DPL0002A-MFG]
D704  TPD1E0B04DPLR  [FP-DPL0002A-MFG]
J701  TC2050-IDC-NL  [TAG-CONNECT_TC2050-IDC-NL]
J702  533980471  [FP-533980471-MFG]
J703  292303-1  [TE-292303-1_V]
R701  100  [RESC1005X40X25ML05T10]
R702  100k  [FP-RC0402-0_4-IPC_A]
R703  100k  [FP-RC0402-0_4-IPC_A]
S701  KMR211NGLFS  [SW_KMR211NGLFS]
TP700  TP  [FP-S2751-46R-MFG]
TP701  TP_1V8_LDO  [FP-S2751-46R-MFG]
U701  NTS0102GT  [PSON50P100X195X50-8N]
U702  TPS7A0518PDBVT  [SOT95P280X145-5N]
U703  TPS2001CDGNR  [DGN0008D_L]

### Ports
FAN_PWM (see SoM[3D]), FAN_TACH (see SoM[3D]), SLEEP (see SoM[3D]), UART2_RXD (see SoM[3A]), UART2_TXD (see SoM[3A]), USB0_D_N (see SoM[2B]), USB0_D_P (see SoM[2B])

### Nets
1V8_LDO: C706.2 C709.1 J701.1 R702.2 TP701.1 U701.3(VCCA) U701.6(OE) U702.5(OUT)  [also labelled +1V8]
+3V3: R703.1 U703.4(EN)  [project net 3V3_M2]
+5: C708.1 U702.1(IN) U702.3(EN)
+5V: C707.2 C710.1 J702.2 U701.7(VCCB) U703.2(IN) U703.3(IN)  [project net AVDD]
GND: C703.2 C706.1 C707.1 C708.2 C709.2 C710.2 C711.2 D701.2(2_IO) J701.4 J702.1 J703.4(GND) J703.5(SHLD1) J703.6(SHLD2) S701.3(GND) S701.4(GND) U701.2(GND) U702.2(GND) U703.1(GND) U703.9(EP)  [project net 3V3_VDRV]
POWER_BUTTON#: C703.1 D701.1(1_IO) R701.1 R701.2 R702.1 S701.1 S701.2 TP700.1 ; port SLEEP
UART_RX: J701.2 ; port UART2_TXD  [project net DEBUG_TXD_1V8]
UART_TX: J701.3 ; port UART2_RXD  [project net DEBUG_RXD_1V8]
USB2_1_D+: D704.2(2_IO) J703.3(D+)
USB2_1_D-: D703.2(2_IO) J703.2(D-)
USB_VBUS: C711.1 J703.1(VBUS) U703.6(OUT) U703.7(OUT) U703.8(OUT)
NetD703_1: D703.1(1_IO) ; port USB0_D_N
NetD704_1: D704.1(1_IO) ; port USB0_D_P
NetJ15A_208: U701.4(A2) ; port FAN_TACH
NetJ15A_230: U701.5(A1) ; port FAN_PWM
NetJ702_3: J702.3 U701.1(B2)
NetJ702_4: J702.4 U701.8(B1)
NetR703_2: R703.2 U703.5(~{FLT})

Not connected (* = marked no-connect by the designer): J701 5* 6* 7* 8* 9* 10*; J702 5(MNT_1)* 6(MNT_2)*; U702 4(NC)*

### Notes on the sheet
- POWER ON
- FAN
- (near U702) 1V8 LDO
- (near R702) Short press- power on, long press - power off
- Power button
- (near J701) UART_DEBUGGER
- Trackpad
- Peripherals
- 7
- A

### Library data of the parts
C703 = CMP-06035-003750-1: as C502 on sheet Battery; Weight: 0.000212oz; Package Quantity: 50000; Resistor Type: Ceramic; Mount: Surface Mount; Width: 0.5mm; Case Code (Imperial): 0402; Termination: SMD/SMT; Case/Package: 0402; Voltage Rating: 50V; Height: 0.5mm; Length: 0.039inch; Dielectric: X7R; Case Code (Metric): 1005; Min Operating Temperature: -55°C; Thickness: 0.022inch; Tolerance: 10%; Lead Free: Lead Free; Packaging: Tape and Reel; Max Operating Temperature: 125°C; Voltage Rating (DC): 50V
C706 C707 = CMP-2008-04639-2: as C603 on sheet DCDC; Weight: 0.000212oz; Thickness: 0.022inch; Voltage Rating (DC): 50V; Dielectric Material: Ceramic; Termination: SMD/SMT; Case/Package: 0402; Case Code (Imperial): 0402; Mount: Surface Mount; REACH SVHC: No SVHC; Resistor Type: Ceramic; Dielectric: X7R; Max Operating Temperature: 125°C; Voltage: 50V; Lead Free: Lead Free; Package Quantity: 10000; Packaging: Tape and Reel; Capacitance: 100nF; Length: 1mm; Material: Ceramic; Height: 0.5mm; Depth: 0.5mm; Width: 0.5mm; Min Operating Temperature: -55°C; Tolerance: 10%; Case Code (Metric): 1005; Voltage Rating: 50V
C708 C711 = CMP-06035-005515-1: as C501 on sheet Battery; Dielectric: X7R; Max Operating Temperature: 125°C; Capacitance: 10uF; Voltage Rating (DC): 25V; Case/Package: 1206; Thickness: 0.071inch; Tolerance: 10%; Voltage Rating: 25V; Mount: Surface Mount; Width: 0.063inch; Length: 0.126inch; Min Operating Temperature: -55°C; Packaging: Tape and Reel; Lead Free: Lead Free; Voltage: 25V
C709 C710 = CMP-2008-04556-2: as C606 on sheet DCDC; Octopart: https://octopart.com/grm155r61a105ke15d-murata-197442; Lead Free: Yes; ComponentLink2Description: Datasheet; Temperature: -55°C to +85°C; Temperature Range High: +85°C; Height: 0.55mm; Capacitance: 1uF; Ipc Land Pattern Name: CAPC10050X50; ComponentLink2URL: https://search.murata.co.jp/Ceramy/image/img/A01X/G101/ENG/GRM155R61A105KE15-01A.pdf; Temperature Range Low: -55°C; Device Class L2: Capacitors; Voltage Rating: 10V; RoHS: TRUE; Device Class L1: Passive Components; Device Class L3: Ceramic Capacitors; Temperature Characteristic: X5R; Mouser Description: 0402 1 uF 10 V ±10% Tolerance X5R Surface Mount Multilayer Ceramic Capacitor; Automotive: No; Package: GRM15-0.1; Digikey Description: CAP CER 1UF 10V X5R 0402; Value: 1uF; Category: Cap
D701 = CMP-04989-000020-1: TVS DIODE 3.6V 19V 2X1SON; Number of Channels: 1; Power Line Protection: No; Peak Pulse Current: 1.7A; Peak Pulse Power: 15W; Interface: USB; Min Breakdown Voltage: 6.7V; Case Code (Imperial): 0402; Resistor Type: Zener; RoHS Compliant: Yes; Case/Package: 0402; Case Code (Metric): 1006; Max Operating Temperature: 125°C; Packaging: Cut Tape; Clamping Voltage: 19V; Mount: Surface Mount; Number of Bidirectional Channels: 1; Min Operating Temperature: -40°C; Reverse Standoff Voltage: 3.6V
D703 D704 = CMP-04989-000017-1: TVS DIODE 3.6V 10.1V 2X2SON; Interface: USB; Number of Channels: 1; Max Operating Temperature: 125°C; Min Operating Temperature: -40°C; RoHS Compliant: Yes; Lead Free: Lead Free
J701 = CMP-002-00074-1: Adapter Cbl Plug Of Nails 10PIN
J702 = CMP-04776-000105-1: CONN HEADER SMD 4POS 1.25MM; Manufacturer: Molex; Conn Gender: Male; Conn Orientation: Vertical; Standoff Height: 0.05mm; Number Of Contacts: 4; Current Rating: 1A; Voltage Rating: 125V; Package: 0; ComponentLink2Description: Datasheet; ComponentLink2URL: https://www.molex.com/pdm_docs/ps/PS-51021-024-001.pdf; Ambient Temperature Range Low: -40°C; Category: Conn; Automotive: No; Number Of Rows: 1; Device Class L3: unset; Ambient Temperature Range High: +105°C; Height: 5.1mm; Lead Free: Yes; Pitch: 1.25mm; Contact Material: Tin; Footprint Url: https://www.molex.com/pdm_docs/sd/533980471_sd.pdf; Octopart: https://octopart.com/53398-0471-molex-655296; Temperature Range Low: -40°C; Device Class L2: Headers and Wire Housings; Temperature: -40°C to +105°C; Digikey Description: CONN HEADER SMD 4POS 1.25MM; RoHS: TRUE; Manufacturer Part Number: 533980471; Device Class L1: Connectors; Temperature Range High: +105°C
J703 = CMP-2000-05404-1: 1 Port Right Angle Through Hole Mount Female Type A USB Connector, 4 Position, -55 to 85 degC, RoHS, Tube; Manufacturer: TE Connectivity; Contact Termination Type: Solder; No. of Contacts: 4; Connector Mounting: PCB; SVHC: NoSVHC(16-Jun-2014); Gender: Receptacle; Connector Type: USBA; Package Description: 4-Pin Through Hole Device, Body 14 x 13.13 mm, Pitch 2.5 mm; Contact Plating: Gold; Package Reference: 292303-1; Contact Material: Copper; Datasheet URL: http://www.farnell.com/cad/1653030.pdf; Datasheet Version: Feb-12; Manufacturer URL: http://www.te.com/
R701 = CMP-2002-07344-1: as R506 on sheet Battery
R702 R703 = CMP-2002-07913-2: as R501 on sheet Battery; Tolerance: 5%; Packaging: Tape and Reel; Termination: SMD/SMT; Case Code (Metric): 1005; Length: 1mm; Power Rating: 63mW; Min Operating Temperature: -55°C; Case/Package: 0402; Construction: Rectangular; Series: RC; Resistance Tolerance: 5%; Height: 0.016inch; Case Code (Imperial): 0402; RoHS Compliant: Yes; Size Code: 0402; Number of Terminations: 2; Features: Moisture Resistant; Width: 0.02inch; Max Operating Temperature: 155°C; Military Standard: Not; Lead Free: Lead Free; Depth: 0.5mm; Package Quantity: 1; Resistor Type: Thick Film
S701 = CMP-016-00013-1: Switch Tactile N.O. SPST Round Button Gull Wing 0.05A 32VDC 1VA 200000Cycle 1.2N SMD T/R; Mounting Technology: Surface Mount; Min Operating Temperature: -40°C; Case/Package: SMD/SMT; Max Operating Temperature: 85°C
TP700 TP701 = CMP-15817-000010-1: as TP500 on sheet Battery; Color: Natural; Material: Copper Alloy; Mount: Surface Mount; Packaging: Cut Tape
U701 = CMP-015-00011-1: Line Transceiver, PDSO8, 1 X 1.95 Mm, 0.50 Mm Height, Plastic, MO-252, SOT833-1, SON-8; Max Supply Voltage: 3.6V; Min Supply Voltage: 1.65V; Pins: 8; Mounting Technology: Standard; Max Operating Temperature: 125°C; Min Operating Temperature: -40°C
U702 = CMP-019-00049-1: 200mA, ultra-low-IQ, high-accuracy, low-dropout voltage regulator with enable 5-SOT-23 -40 to 125; Output Voltage: 1.8V; Pins: 5; Case/Package: SOT-23
U703 = CMP-0337-00296-2: Single Channel, Current-Limited USB Power Distribution Switch, 2.9 A Current Limit, -40 to 85 degC, 8-pin MSOP-PowerPAD (DGN), Green (RoHS & no Sb/Br); Manufacturer: Texas Instruments; Enable: Active High; rDS(on) per FET(Typ)(mOhms): 70; Current Limit(A): 2.9; Discharge Function: TRUE; Vin(Max)(V): 5.5; Vin(Min)(V): 4.5; Rating: Catalog; Number of Switches: 1; Continuous Current(Max)(A): 2; PackageReference: DGN0008D; ComponentLink1Description: Datasheet; DatasheetVersion: SLVSAU6E; Eco-Plan: Green (RoHS & no Sb/Br); Code_JEDEC: MO-187-AA-T; PackageDescription: 8-Pin PowerPAD Plastic Small Outline Package 3 x 3 mm Body ,0.65 mm Pitch, Exposed Pad; PackageVersion: revF, May-2011; UL Listed: TRUE; PartNumber: TPS2001CDGNR; Mounting Technology: Surface Mount; ComponentLink1URL: http://www.ti.com/general/docs/lit/getliterature.tsp?genericPartNumber=TPS2001C&fileType=pdf

## Sheet Audio.SchDoc
size A3; SheetNumber: 8; SheetTotal: 9
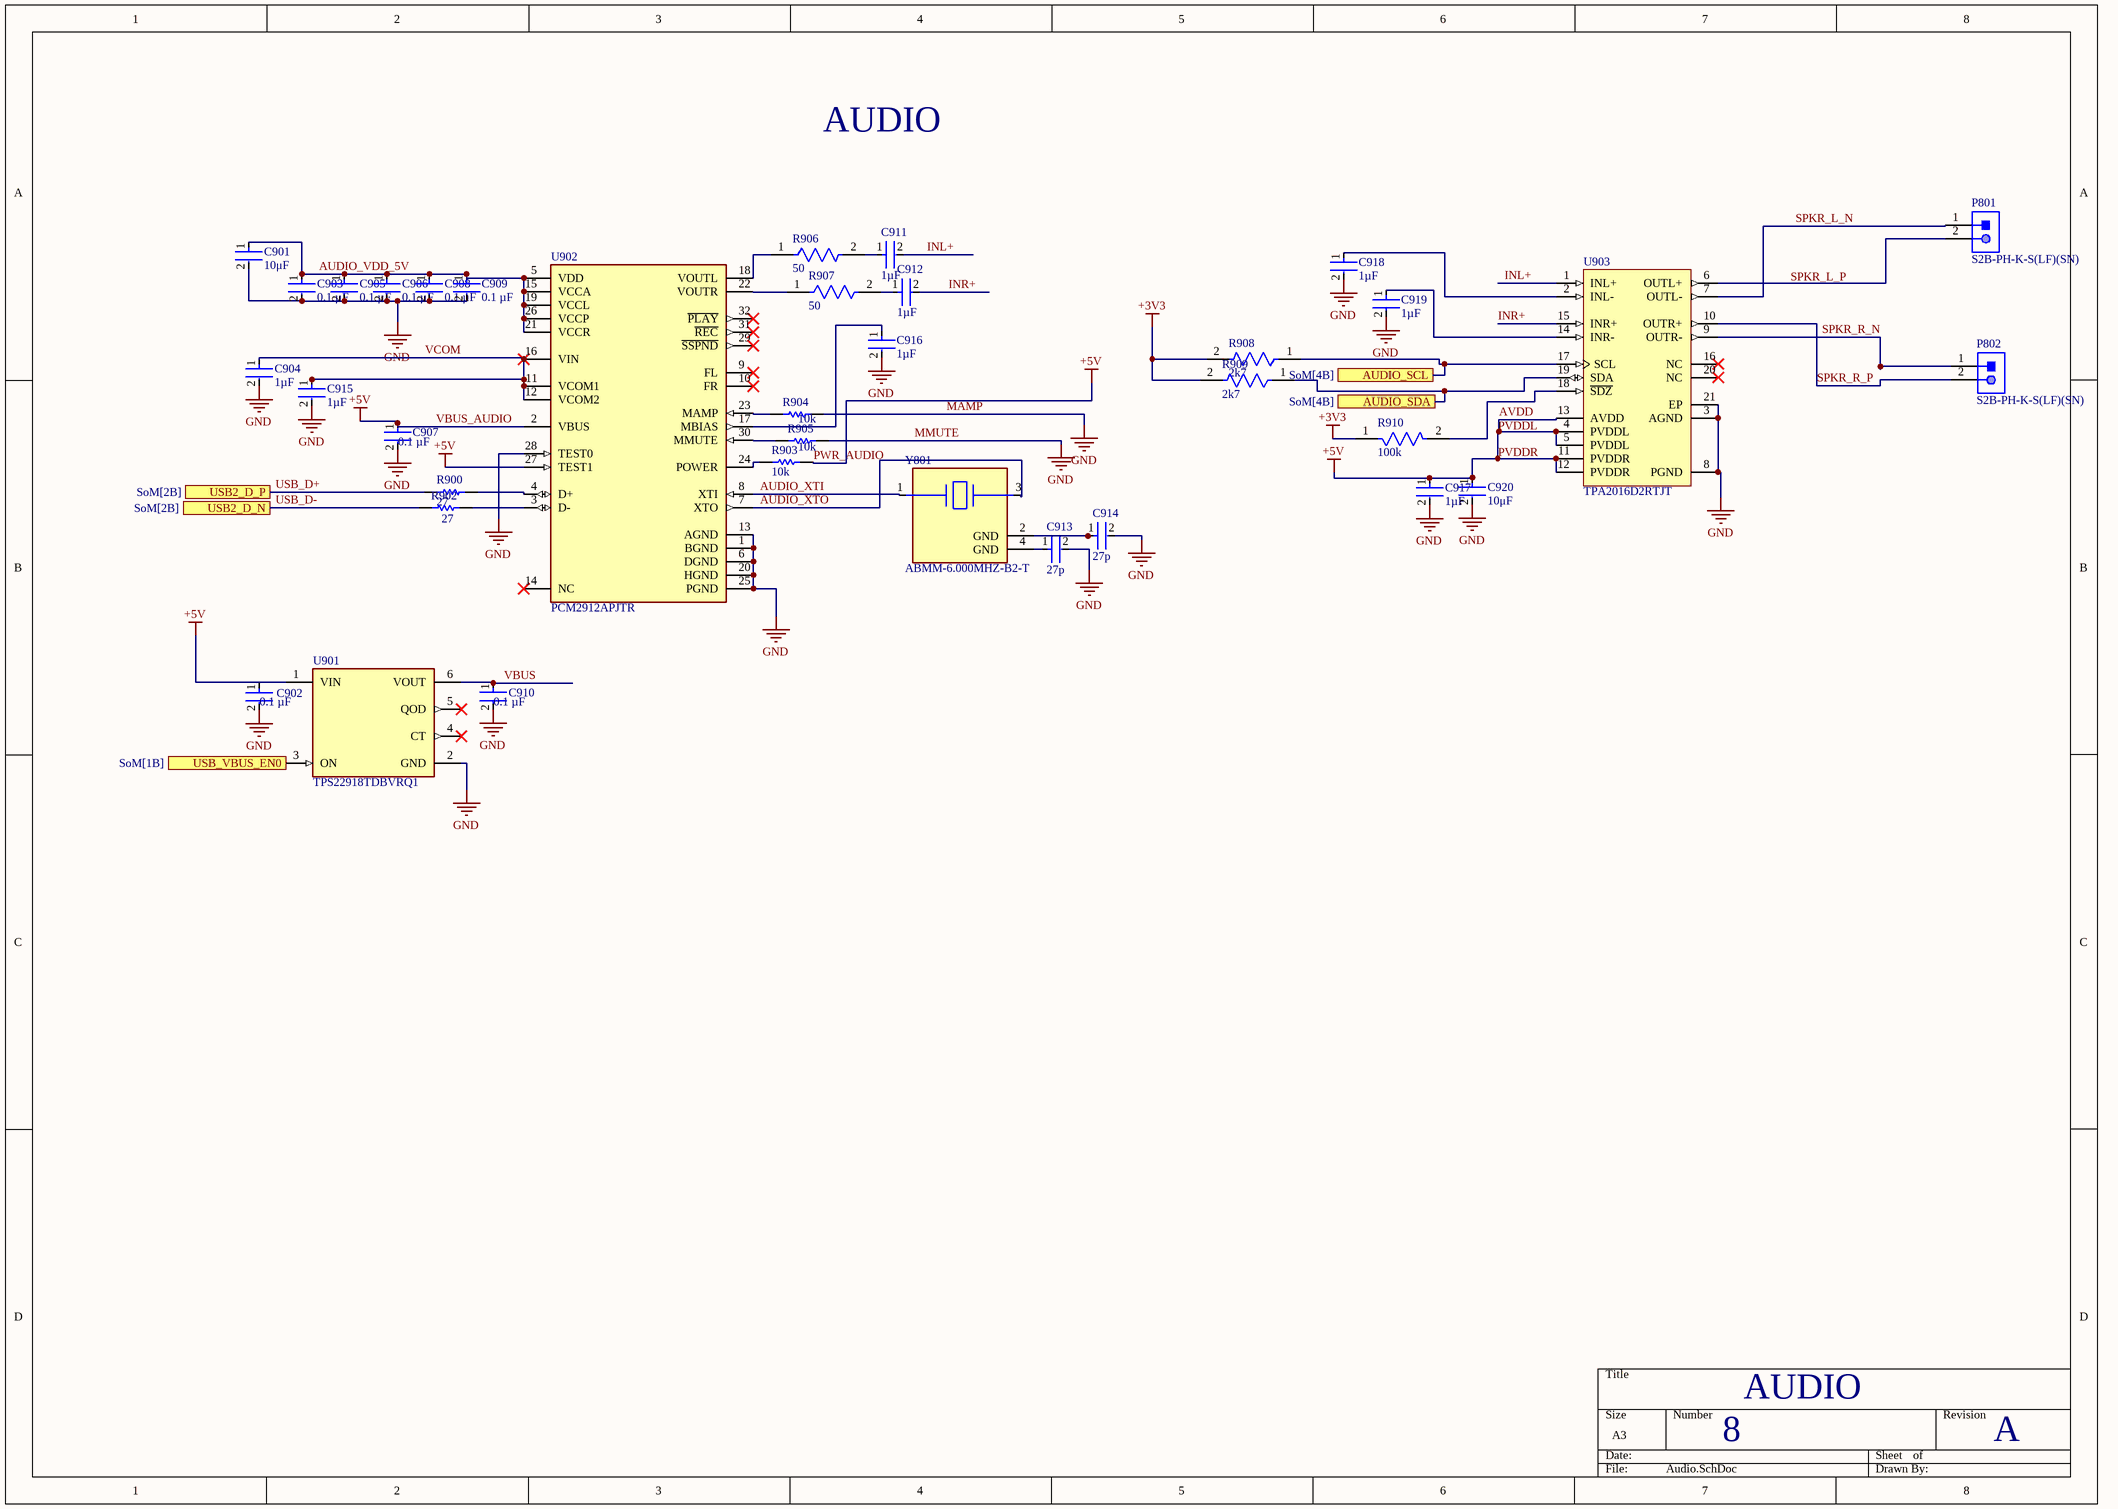
[diagram p8: Audio.SchDoc]

### Parts
C901  10μF  [FP-GRM31C-0_2-e0_3_0_8-MFG]
C902  0.1 µF  [FP-GRM155-0_05-IPC_B]
C903  0.1 µF  [FP-GRM155-0_05-IPC_B]
C904  1µF  [FP-GRM15-0_1-MFG]
C905  0.1 µF  [FP-GRM155-0_05-IPC_B]
C906  0.1 µF  [FP-GRM155-0_05-IPC_B]
C907  0.1 µF  [FP-GRM155-0_05-IPC_B]
C908  0.1 µF  [FP-GRM155-0_05-IPC_B]
C909  0.1 µF  [FP-GRM155-0_05-IPC_B]
C910  0.1 µF  [FP-GRM155-0_05-IPC_B]
C911  1µF  [FP-GRM15-0_1-MFG]
C912  1µF  [FP-GRM15-0_1-MFG]
C913  27p  [FP-C0603C-CF-MFG]
C914  27p  [FP-C0603C-CF-MFG]
C915  1µF  [FP-GRM15-0_1-MFG]
C916  1µF  [FP-GRM15-0_1-MFG]
C917  1µF  [FP-GRM15-0_1-MFG]
C918  1µF  [FP-GRM15-0_1-MFG]
C919  1µF  [FP-GRM15-0_1-MFG]
C920  10μF  [FP-GRM31C-0_2-e0_3_0_8-MFG]
P801  S2B-PH-K-S(LF)(SN)  [JST-S2B-PH-K-S_V]
P802  S2B-PH-K-S(LF)(SN)  [JST-S2B-PH-K-S_V]
R900  27  [RESC1005X40X25LL05T10]
R902  27  [RESC1005X40X25LL05T10]
R903  10k  [RESC1005X40X25LL05T10]
R904  10k  [RESC1005X40X25LL05T10]
R905  10k  [RESC1005X40X25LL05T10]
R906  50  [FP-CRCW0603-e3-MFG]
R907  50  [FP-CRCW0603-e3-MFG]
R908  2k7  [FP-CR0402-IPC_B]
R909  2k7  [FP-CR0402-IPC_B]
R910  100k  [FP-RC0402-0_4-IPC_A]
U901  TPS22918TDBVRQ1  [FP-DBV0006A-IPC_C]
U902  PCM2912APJTR  [FP-PJT0032A-IPC_C]
U903  TPA2016D2RTJT  [RTJ0020D_V]
Y801  ABMM-6.000MHZ-B2-T  [FP-ABMM-MFG]

### Ports
AUDIO_SCL (see SoM[4B]), AUDIO_SDA (see SoM[4B]), USB2_D_N (see SoM[2B]), USB2_D_P (see SoM[2B]), USB_VBUS_EN0 (see SoM[1B])

### Nets
+3V3: R908.2 R909.2 R910.1  [project net 3V3_M2]
AVDD: C917.1 C920.1 R903.1 U901.1(VIN) U902.27(TEST1) U903.4(PVDDL) U903.5(PVDDL) U903.11(PVDDR) U903.12(PVDDR) U903.13(AVDD)  [also labelled +5V, PVDDL, PVDDR, PWR_AUDIO]
GND: C901.2 C902.2 C903.2 C904.2 C905.2 C906.2 C907.2 C908.2 C909.2 C910.2 C913.2 C914.2 C915.2 C916.2 C917.2 C918.2 C919.2 C920.2 R904.1 R905.1 U901.2(GND) U902.1(BGND) U902.6(DGND) U902.13(AGND) U902.20(HGND) U902.25(PGND) U902.28(TEST0) U903.3(AGND) U903.8(PGND) U903.21(EP)  [also labelled MAMP, MMUTE]  [project net 3V3_VDRV]
AUDIO_VDD_5V: C901.1 C903.1 C905.1 C906.1 C908.1 C909.1 U902.5(VDD) U902.15(VCCA) U902.19(VCCL) U902.21(VCCR) U902.26(VCCP)
AUDIO_XTI: U902.8(XTI) Y801.1
AUDIO_XTO: U902.7(XTO) Y801.3
INL+: C911.2 U903.1(INL+)
INR+: C912.2 U903.15(INR+)
SPKR_L_N: P801.1 U903.7(OUTL-)
SPKR_R_N: P802.1 U903.9(OUTR-)
SPKR_R_P: P802.2 U903.10(OUTR+)
USB_D+: R900.1 ; port USB2_D_P
USB_D-: R902.1 ; port USB2_D_N
VBUS: C910.1 U901.6(VOUT)
VBUS_AUDIO: C907.1 U902.2(VBUS)
VCOM: C904.1 C915.1 U902.11(VCOM1) U902.12(VCOM2) U902.16(VIN)
NetC911_1: C911.1 R906.2
NetC912_1: C912.1 R907.2
NetC913_1: C913.1 Y801.4(GND)
NetC914_1: C914.1 Y801.2(GND)
NetC916_1: C916.1 U902.17(MBIAS)
NetC918_1: C918.1 U903.2(INL-)
NetC919_1: C919.1 U903.14(INR-)
NetJ15A_87: U901.3(ON) ; port USB_VBUS_EN0
NetJ15A_185: R908.1 U903.17(SCL) ; port AUDIO_SCL
NetJ15A_187: R909.1 U903.19(SDA) ; port AUDIO_SDA
NetP801_2: P801.2 U903.6(OUTL+)
NetR900_2: R900.2 U902.4(D+)
NetR902_2: R902.2 U902.3(D-)
NetR903_2: R903.2 U902.24(POWER)
NetR904_2: R904.2 U902.23(MAMP)
NetR905_2: R905.2 U902.30(MMUTE)
NetR906_1: R906.1 U902.18(VOUTL)
NetR907_1: R907.1 U902.22(VOUTR)
NetR910_2: R910.2 U903.18(~{SDZ})

Not connected (* = marked no-connect by the designer): C902 1; U901 4(CT)* 5(QOD)*; U902 9(FL)* 10(FR)* 14(NC)* 29(~{SSPND})* 31(~{REC})* 32(~{PLAY})*; U903 16(NC)* 20(NC)*

### Notes on the sheet
- AUDIO
- 8
- A
- Labels drawn without touching a wire or pin: SPKR_L_P

### Library data of the parts
C901 C920 = CMP-06035-005515-1: as C501 on sheet Battery; Dielectric: X7R; Max Operating Temperature: 125°C; Capacitance: 10uF; Voltage Rating (DC): 25V; Case/Package: 1206; Thickness: 0.071inch; Tolerance: 10%; Voltage Rating: 25V; Mount: Surface Mount; Width: 0.063inch; Length: 0.126inch; Min Operating Temperature: -55°C; Packaging: Tape and Reel; Lead Free: Lead Free; Voltage: 25V
C902 C903 C905-C910 = CMP-06035-003750-1: as C502 on sheet Battery; Weight: 0.000212oz; Package Quantity: 50000; Resistor Type: Ceramic; Mount: Surface Mount; Width: 0.5mm; Case Code (Imperial): 0402; Termination: SMD/SMT; Case/Package: 0402; Voltage Rating: 50V; Height: 0.5mm; Length: 0.039inch; Dielectric: X7R; Case Code (Metric): 1005; Min Operating Temperature: -55°C; Thickness: 0.022inch; Tolerance: 10%; Lead Free: Lead Free; Packaging: Tape and Reel; Max Operating Temperature: 125°C; Voltage Rating (DC): 50V
C904 C911 C912 C915-C919 = CMP-2008-04556-2: as C606 on sheet DCDC; Octopart: https://octopart.com/grm155r61a105ke15d-murata-197442; Lead Free: Yes; ComponentLink2Description: Datasheet; Temperature: -55°C to +85°C; Temperature Range High: +85°C; Height: 0.55mm; Capacitance: 1uF; Ipc Land Pattern Name: CAPC10050X50; ComponentLink2URL: https://search.murata.co.jp/Ceramy/image/img/A01X/G101/ENG/GRM155R61A105KE15-01A.pdf; Temperature Range Low: -55°C; Device Class L2: Capacitors; Voltage Rating: 10V; RoHS: TRUE; Device Class L1: Passive Components; Device Class L3: Ceramic Capacitors; Temperature Characteristic: X5R; Mouser Description: 0402 1 uF 10 V ±10% Tolerance X5R Surface Mount Multilayer Ceramic Capacitor; Automotive: No; Package: GRM15-0.1; Digikey Description: CAP CER 1UF 10V X5R 0402; Value: 1uF; Category: Cap
C913 C914 = CMP-03020-010139-1: C0603 27 pF X7R 30ppm/°C 5.00% 50 V; Manufacturer: KEMET; Manufacturer Part Number: C0603C270J5RACTU; Capacitance: 27 pF; Voltage Rating: 50 V; Material: Ceramic; Automotive Grade: Grade 1; Tolerance: 0.05; Value: 27 pF; Automotive: Yes; Device Class L1: Passive Components; Device Class L3: Ceramic Capacitors; Lead Free: Yes; Temperature Coefficient: 30ppm/°C; ComponentLink2Description: Datasheet; RoHS: TRUE; Temperature Range Low: -55°C; ComponentLink2URL: https://api.kemet.com/component-edge/download/datasheet/C0603C100J5GACAUTO.pdf; Category: Cap; Temperature Range High: +125°C; Temperature Characteristic: X7R; Height: 0.87mm; Octopart: https://octopart.com/c0603c270j5ractu-kemet-82267354; Package: C0603C-CF; Temperature: -55°C to +125°C; Device Class L2: Capacitors
P801 P802 = CMP-1755-00004-1: Male Header, Pitch 2 mm, 1 x 2 Position, Height 4.8 mm, Tail Length 3.4 mm, -25 to 85 degC, RoHS, Bulk; Case\Package: Radial; Tolerance: 20%; Capacitance: 10 uF; Voltage Rating (DC): 50 V; Packaging: Bulk; ComponentLink1URL: http://www.jst-mfg.com/product/pdf/eng/ePH.pdf; Radiation Hardening: No; Height: 11 mm; Package Quantity: 200; PackageDescription: Male Header, Pitch 2 mm, 1 x 2 Position, Height 4.8 mm, Tail Length 3.4 mm; PackageReference: S2B-PH-K-S; Diameter: 5 mm; Pins: 2; Mount: Through Hole; Max Operating Temperature: 85 degC; Min Operating Temperature: -40 degC; ComponentLink1Description: Datasheet; DatasheetVersion: Dec-12; Length: 11 mm; Lead Pitch: 2 mm; REACH SVHC: No SVHC; Voltage Rating: 50 V; RoHSCompliant: true
R900 R902 = CMP-2002-07055-1: Part Number: RC0402FR-0727RL; Manufacturer: Yageo / Phycomp
R903-R905 = CMP-2002-07353-1: as R509 on sheet Battery
R906 R907 = CMP-2000-03436-2: RES Thick Film, 50Ω, 1%, 0.1W, 100ppm/°C, 0603; Voltage Rating (DC): 75V; Resistance: 50R; Power Rating: 100mW; Case/Package: 0603; Packaging: Tape and Reel; Military Standard: Not; REACH SVHC: No SVHC; Width: 0.85mm; Max Operating Temperature: 155°C; Case Code (Metric): 1608; Temperature Coefficient: 100ppm/°C; Lead Free: Lead Free; Height: 0.45mm; Composition: Thick Film; Termination: SMD/SMT; Contact Plating: Tin; Number of Pins: 2; Tolerance: 1%; Depth: 0.85mm; Weight: 7.1E-05oz; Min Operating Temperature: -55°C; Length: 1.55mm; Radiation Hardening: No; Voltage Rating: 75V; Case Code (Imperial): 0603; Package Quantity: 5000; Mount: Surface Mount
R908 R909 = CMP-2002-05009-2: as R602 on sheet DCDC; Tolerance: 1%; Max Operating Temperature: 125°C; Mount: Surface Mount; Case Code (Imperial): 0402; Package Quantity: 10000; Composition: Thick Film; Depth: 0.5mm; Thickness: 356um; Case/Package: 0402; Min Operating Temperature: -55°C; Case Code (Metric): 1005; Contact Plating: Tin; Width: 0.02inch; Packaging: Tape and Reel; Height: 0.016inch; Number of Terminations: 2; Length: 1mm; Temperature Coefficient: 100ppm/°C; Termination: SMD/SMT; Radiation Hardening: No; Military Standard: Not
R910 = CMP-2002-07913-2: as R501 on sheet Battery; Tolerance: 5%; Packaging: Tape and Reel; Termination: SMD/SMT; Case Code (Metric): 1005; Length: 1mm; Power Rating: 63mW; Min Operating Temperature: -55°C; Case/Package: 0402; Construction: Rectangular; Series: RC; Resistance Tolerance: 5%; Height: 0.016inch; Case Code (Imperial): 0402; RoHS Compliant: Yes; Size Code: 0402; Number of Terminations: 2; Features: Moisture Resistant; Width: 0.02inch; Max Operating Temperature: 155°C; Military Standard: Not; Lead Free: Lead Free; Depth: 0.5mm; Package Quantity: 1; Resistor Type: Thick Film
U901 = CMP-04910-000092-1: IC PWR SWITCH N-CHAN 1:1 SOT23-6; Interface: On/Off; Number of Channels: 1; Output Configuration: High Side; Max Output Current: 2A; Case/Package: SOT-23-6; Max Operating Temperature: 105°C; Packaging: Tape and Reel; Lead Free: Lead Free; Number of Outputs: 1; Min Operating Temperature: -40°C; RoHS Compliant: Yes
U902 = CMP-04873-000003-1: IC STEREO AUD CODEC W/USB 32TQFP; Interface: USB; Number of D/A Converters: 1; Min Supply Voltage: 3V; Max Supply Voltage: 5.25V; Operating Supply Voltage: 5V; Signal to Noise Ratio (SNR): 92dB; Number of Analog Outputs: 2; Sampling Rate: 48KS/s; Resolution: 16b; Package Quantity: 1000; Max Operating Temperature: 85°C; Series: -; Radiation Hardening: No; Number of Analog Inputs: 1; Packaging: Tape and Reel; Number of ADC Channels: 1; Mount: Surface Mount; Number of Pins: 32; Lead Free: Lead Free; RoHS Compliant: Yes; Number of A/D Converters: 1; Contact Plating: Gold; Min Operating Temperature: -25°C; Case/Package: TQFP; Type: General Purpose; Number of DAC Channels: 2
U903 = CMP-0991-00197-2: 2.8-W/Ch Stereo Class-D Audio Amplifier with SmartGainTM AGC / DRC, -40 to 85 degC, 20-pin QFN (RTJ20), Green (RoHS & no Sb/Br); Manufacturer: Texas Instruments; Supply Max(Max)(Volt): 5.5; Supply Min(Min)(Volt): 2.5; SubFamily: Dynamic Speaker; Output Power(W): 2.8; PSRR(dB): -80; Speaker Channels: Stereo; Special Features: AGC/DRC; Mounting Technology: Surface Mount; PartNumber: TPA2016D2RTJT; ComponentLink3Description: Package Specification; Speaker Amp Type: Class-D; ComponentLink1Description: Manufacturer URL; ComponentLink2Description: Datasheet; Eco-Plan: Green (RoHS & no Sb/Br); DatasheetVersion: SLOS524D; PackageReference: RTJ0020D; PackageDescription: 20-pin Plastic Flat Pack, Body 4 x 4 mm, Pitch 0.5 mm; ComponentLink1URL: http://www.ti.com/; ComponentLink3URL: http://www.ti.com/litv/pdf/mpqf156e; ComponentLink2URL: http://www.ti.com/general/docs/lit/getliterature.tsp?genericPartNumber=TPA2016D2&fileType=pdf; PackageVersion: 4205505/F, 07/2011
Y801 = CMP-27762-012698-1: CRYSTAL 6.0000MHZ 18PF SMD; Frequency Tolerance: 20ppm; Frequency: 6MHz; Series Resistance: 70R; Operating Frequency: 6 MHz; Frequency Stability: 50ppm; Load Capacitance: 18pF; Min Operating Temperature: -20°C; Number of Pins: 4; Packaging: Tape and Reel; Max Operating Temperature: 70°C; Case/Package: SMD/SMT; Tolerance: 20ppm; Height: 0.051inch; Mount: Surface Mount; Width: 5mm; Lead Free: Lead Free; Series: ABMM; ESR (Equivalent Series Resistance): 70R; Length: 0.276inch; Termination: SMD/SMT; Package Quantity: 1000; Resistor Type: Ceramic